# Altium project Fast_Servo.PrjPCB (part 1 of 7)
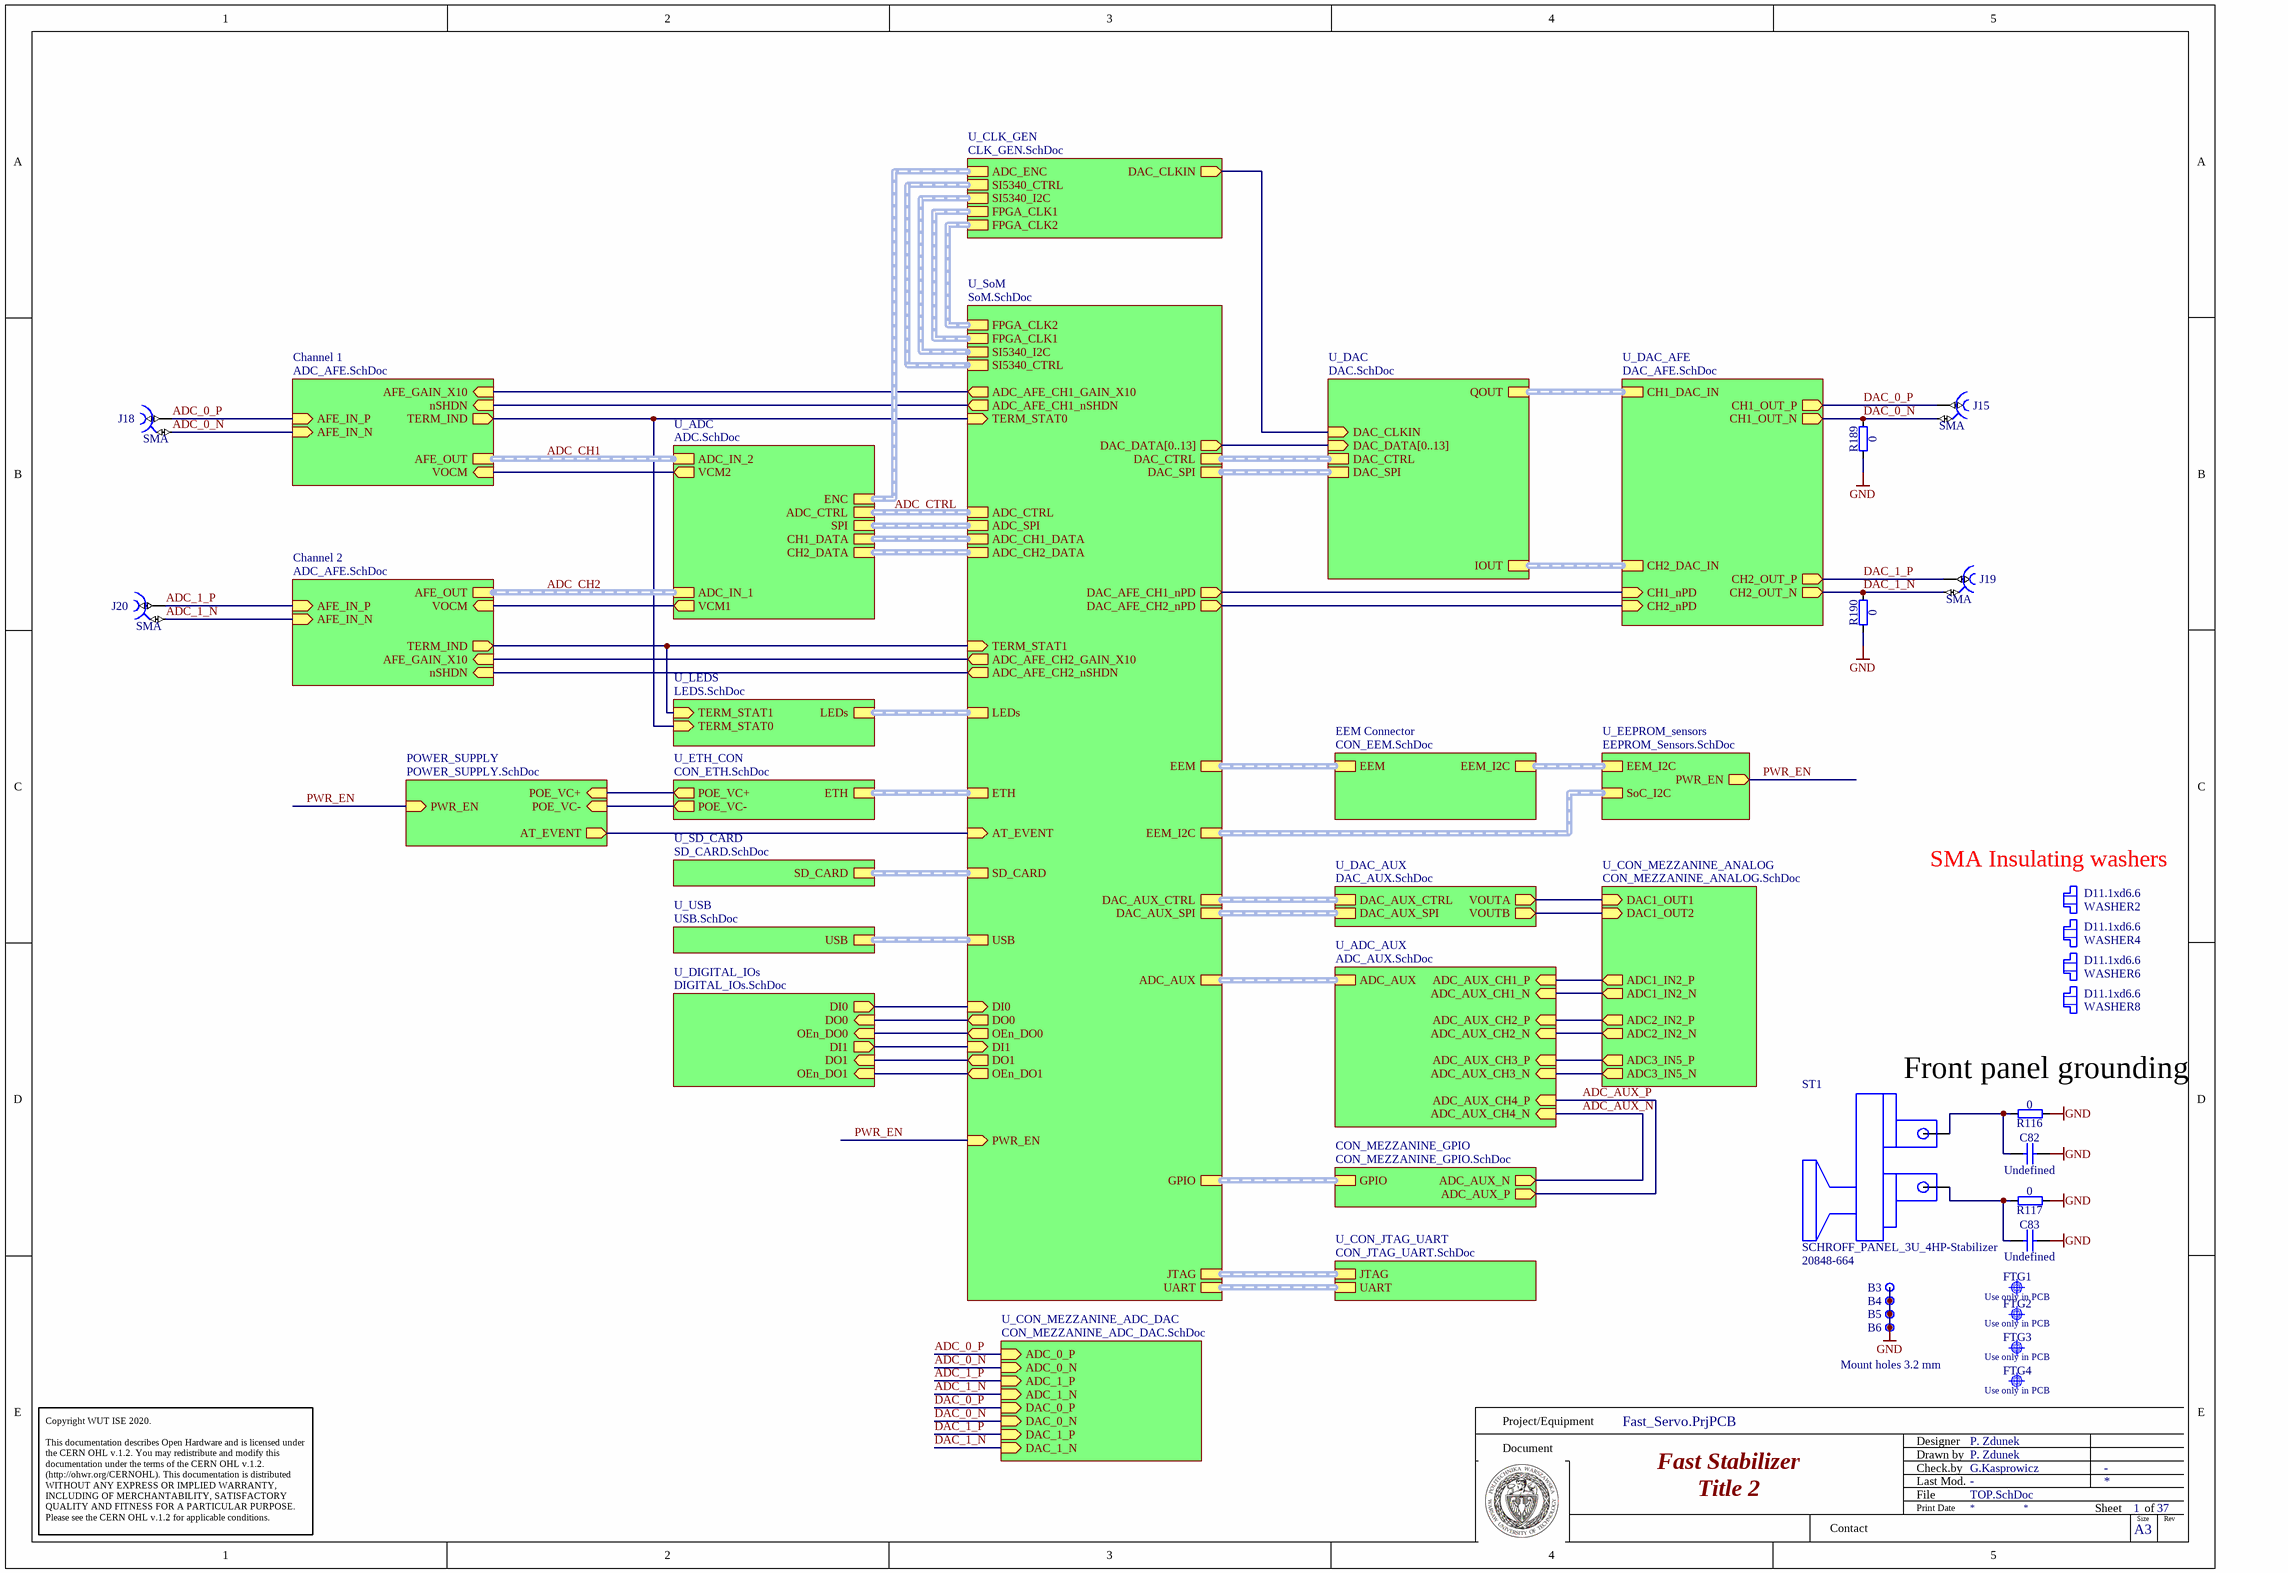
[diagram p0: TOP.SchDoc]
27 sheets, 668 parts. Net scope: hierarchical (ports join the sheet entries above them; power ports are global).
Board files: Fast_Servo.PCBDOC, Panel_Fast_Servo.PcbDoc
Sheets:
  TOP.SchDoc
    U_SoM = SOM.SchDoc
      U_SoM_JB2 = SOM_JB2.SchDoc
      U_SOM_JB1 = SOM_JB1.SchDoc
      U_SOM_JB3 = SOM_JB3.SchDoc
    U_LEDS = LEDS.SchDoc
    U_ADC = ADC.SchDoc
    Channel 2 = ADC_AFE.SchDoc
    Channel 1 = ADC_AFE.SchDoc
    U_DAC_AFE = DAC_AFE.SchDoc
    U_DAC = DAC.SchDoc
    CON_MEZZANINE_GPIO = CON_MEZZANINE_GPIO.SchDoc
    EEM Connector = CON_EEM.SchDoc
    U_EEPROM_sensors = EEPROM_Sensors.SchDoc
    U_DAC_AUX = DAC_AUX.SchDoc
    U_CON_MEZZANINE_ANALOG = CON_MEZZANINE_ANALOG.SchDoc
    U_ADC_AUX = ADC_AUX.SchDoc
    U_CLK_GEN = CLK_GEN.SchDoc
    U_CON_MEZZANINE_ADC_DAC = CON_MEZZANINE_ADC_DAC.SchDoc
    U_ETH_CON = CON_ETH.SchDoc
    POWER_SUPPLY = POWER_SUPPLY.SchDoc
      U_PWR_SMPS = PWR_SMPS.SchDoc
      PWR_P12V0A_N12V0A = PWR_P12V0A_N12V0A.SchDoc
      U_PWR_LDOs = PWR_LDOs.SchDoc
    U_SD_CARD = SD_CARD.SchDoc
    U_USB = USB.SchDoc
    U_DIGITAL_IOs = DIGITAL_IOs.SchDoc
    U_CON_JTAG_UART = CON_JTAG_UART.SchDoc

## Sheet TOP.SchDoc: Fast Stabilizer
size 420 x 297 mm; CheckedBy: G.Kasprowicz; Author: P. Zdunek; DrawnBy: P. Zdunek; Organization: Altium Limited; DocumentNumber: 1; SheetNumber: 1; SheetTotal: 37; Designer: P. Zdunek; ModifiedBy: -; CheckedDate: -; Title2: Title 2; DivGrp: WUT ISE

### Parts
B3  Plated Hole  [MTG320_550]  (value not drawn)  (no BOM)
B4  Plated Hole  [MTG320_550]  (value not drawn)  (no BOM)
B5  Plated Hole  [MTG320_550]  (value not drawn)  (no BOM)
B6  Plated Hole  [MTG320_550]  (value not drawn)  (no BOM)
C82  Undefined  [CAPC1608X90N]
C83  Undefined  [CAPC1608X90N]
FTG1  Use only in PCB  [FIDUCIAL_TOP_C100-200]  (no BOM)
FTG2  Use only in PCB  [FIDUCIAL_TOP_S100-200]  (no BOM)
FTG3  Use only in PCB  [FIDUCIAL_TOP_S100-200]  (no BOM)
FTG4  Use only in PCB  [FIDUCIAL_TOP_S100-200]  (no BOM)
J15  SMA  [DELOCK_65848]
J18  SMA  [DELOCK_65848]
J19  SMA  [DELOCK_65848]
J20  SMA  [DELOCK_65848]
R116  0  [RESC1005X40N]
R117  0  [RESC1005X40N]
R189  0  [RESC1005X40N]
R190  0  [RESC1005X40N]
ST1  SCHROFF_PANEL_3U_4HP-Stabilizer  Manufacturer Part Number 2: 20848-664  [SCHROFF_PANEL_3HP_4U - Stabilizer]
WASHER2  D11.1xd6.6  [Keystone_7687]
WASHER4  D11.1xd6.6  [Keystone_7687]
WASHER6  D11.1xd6.6  [Keystone_7687]
WASHER8  D11.1xd6.6  [Keystone_7687]

### Sub-sheets
Channel 1 = ADC_AFE.SchDoc: AFE_OUT (harness DIFF_SIGNAL), VOCM (in), AFE_IN_P (in), AFE_IN_N (in), nSHDN (in), AFE_GAIN_X10 (in), TERM_IND (out)
Channel 2 = ADC_AFE.SchDoc: AFE_OUT (harness DIFF_SIGNAL), VOCM (in), AFE_IN_P (in), AFE_IN_N (in), nSHDN (in), AFE_GAIN_X10 (in), TERM_IND (out)
CON_MEZZANINE_GPIO = CON_MEZZANINE_GPIO.SchDoc: GPIO (harness GPIO), ADC_AUX_P (out), ADC_AUX_N (out)
EEM Connector = CON_EEM.SchDoc: EEM (harness EEM), EEM_I2C (harness EEM_I2C)
POWER_SUPPLY = POWER_SUPPLY.SchDoc: POE_VC+ (in), POE_VC- (in), AT_EVENT (out), PWR_EN (in)
U_ADC = ADC.SchDoc: ADC_IN_1 (harness DIFF_SIGNAL), VCM1 (out), VCM2 (out), ADC_IN_2 (harness DIFF_SIGNAL), CH1_DATA (harness LTC2195_DATA), CH2_DATA (harness LTC2195_DATA), SPI (harness LTC2195_SPI), ENC (harness DIFFCLK), ADC_CTRL (harness LTC2195_CTRL)
U_ADC_AUX = ADC_AUX.SchDoc: ADC_AUX_CH3_P (in), ADC_AUX_CH3_N (in), ADC_AUX_CH2_P (in), ADC_AUX_CH2_N (in), ADC_AUX_CH1_P (in), ADC_AUX_CH1_N (in), ADC_AUX (harness ADC_AUX), ADC_AUX_CH4_N (in), ADC_AUX_CH4_P (in)
U_CLK_GEN = CLK_GEN.SchDoc: SI5340_CTRL (harness SI5340_CTRL), SI5340_I2C (harness I2C), FPGA_CLK1 (harness DIFFCLK), FPGA_CLK2 (harness DIFFCLK), DAC_CLKIN (out), ADC_ENC (harness DIFFCLK)
U_CON_JTAG_UART = CON_JTAG_UART.SchDoc: JTAG (harness JTAG), UART (harness UART)
U_CON_MEZZANINE_ADC_DAC = CON_MEZZANINE_ADC_DAC.SchDoc: ADC_0_P (in), ADC_0_N (in), ADC_1_P (in), ADC_1_N (in), DAC_0_P (in), DAC_0_N (in), DAC_1_P (in), DAC_1_N (in)
U_CON_MEZZANINE_ANALOG = CON_MEZZANINE_ANALOG.SchDoc: ADC1_IN2_P (out), ADC1_IN2_N (out), ADC2_IN2_N (out), ADC2_IN2_P (out), ADC3_IN5_P (out), ADC3_IN5_N (out), DAC1_OUT1 (in), DAC1_OUT2 (in)
U_DAC = DAC.SchDoc: QOUT (harness DIFF_SIGNAL), IOUT (harness DIFF_SIGNAL), DAC_DATA[0..13] (in), DAC_CTRL (harness AD9117_DAC_CTRL), DAC_SPI (harness AD9117_DAC_SPI), DAC_CLKIN (in)
U_DAC_AFE = DAC_AFE.SchDoc: CH1_nPD (in), CH1_OUT_P (out), CH1_DAC_IN (harness DIFF_SIGNAL), CH2_DAC_IN (harness DIFF_SIGNAL), CH2_OUT_P (out), CH2_nPD (in), CH1_OUT_N (out), CH2_OUT_N (out)
U_DAC_AUX = DAC_AUX.SchDoc: VOUTA (out), VOUTB (out), DAC_AUX_CTRL (harness DAC_AUX_CTRL), DAC_AUX_SPI (harness DAC_AUX_SPI)
U_DIGITAL_IOs = DIGITAL_IOs.SchDoc: DI1 (out), DI0 (out), OEn_DO0 (in), DO0 (in), OEn_DO1 (in), DO1 (in)
U_EEPROM_sensors = EEPROM_Sensors.SchDoc: EEM_I2C (harness EEM_I2C), SoC_I2C (harness EEM_I2C), PWR_EN (out)
U_ETH_CON = CON_ETH.SchDoc: ETH (harness ETH), POE_VC+ (out), POE_VC- (out)
U_LEDS = LEDS.SchDoc: LEDs (harness LEDs), TERM_STAT1 (in), TERM_STAT0 (in)
U_SD_CARD = SD_CARD.SchDoc: SD_CARD (harness SD_CARD)
U_SoM = SoM.SchDoc: EEM (harness EEM), EEM_I2C (harness EEM_I2C), TERM_STAT1 (in), ADC_AFE_CH2_GAIN_X10 (out), ADC_AFE_CH1_GAIN_X10 (out), TERM_STAT0 (in), LEDs (harness LEDs), ADC_AUX (harness ADC_AUX), DAC_AUX_CTRL (harness DAC_AUX_CTRL), DAC_AUX_SPI (harness DAC_AUX_SPI), DAC_DATA[0..13] (out), DAC_CTRL (harness AD9117_DAC_CTRL), DAC_AFE_CH1_nPD (out), FPGA_CLK2 (harness DIFFCLK), JTAG (harness JTAG), UART (harness UART), GPIO (harness GPIO), SI5340_CTRL (harness SI5340_CTRL), ADC_AFE_CH2_nSHDN (out), ADC_AFE_CH1_nSHDN (out), FPGA_CLK1 (harness DIFFCLK), SI5340_I2C (harness I2C), DAC_SPI (harness AD9117_DAC_SPI), ADC_CH2_DATA (harness LTC2195_DATA), ADC_CH1_DATA (harness LTC2195_DATA), ADC_SPI (harness LTC2195_SPI), ADC_CTRL (harness LTC2195_CTRL), DAC_AFE_CH2_nPD (out), ETH (harness ETH), SD_CARD (harness SD_CARD), USB (harness USB), DI0 (in), DI1 (in), AT_EVENT (in), DO0 (out), OEn_DO0 (out), DO1 (out), OEn_DO1 (out), PWR_EN (in)
U_USB = USB.SchDoc: USB (harness USB)

### Nets
GND: B3.1 B4.1 B5.1 B6.1 C82.2 C83.2 R116.1 R117.1 R189.1 R190.1
ADC_0_N: J18.2 ; sheet Channel 1/AFE_IN_N, sheet U_CON_MEZZANINE_ADC_DAC/ADC_0_N
ADC_0_P: J18.1 ; sheet Channel 1/AFE_IN_P, sheet U_CON_MEZZANINE_ADC_DAC/ADC_0_P
ADC_1_N: J20.2 ; sheet Channel 2/AFE_IN_N, sheet U_CON_MEZZANINE_ADC_DAC/ADC_1_N
ADC_1_P: J20.1 ; sheet Channel 2/AFE_IN_P, sheet U_CON_MEZZANINE_ADC_DAC/ADC_1_P
ADC_AFE_CH1_nSHDN: sheet U_SoM/ADC_AFE_CH1_nSHDN, sheet Channel 1/nSHDN
ADC_AFE_CH2_nSHDN: sheet U_SoM/ADC_AFE_CH2_nSHDN, sheet Channel 2/nSHDN
ADC_AUX_CH1_N: sheet U_CON_MEZZANINE_ANALOG/ADC1_IN2_N, sheet U_ADC_AUX/ADC_AUX_CH1_N
ADC_AUX_CH1_P: sheet U_CON_MEZZANINE_ANALOG/ADC1_IN2_P, sheet U_ADC_AUX/ADC_AUX_CH1_P
ADC_AUX_CH2_N: sheet U_CON_MEZZANINE_ANALOG/ADC2_IN2_N, sheet U_ADC_AUX/ADC_AUX_CH2_N
ADC_AUX_CH2_P: sheet U_CON_MEZZANINE_ANALOG/ADC2_IN2_P, sheet U_ADC_AUX/ADC_AUX_CH2_P
ADC_AUX_CH3_N: sheet U_CON_MEZZANINE_ANALOG/ADC3_IN5_N, sheet U_ADC_AUX/ADC_AUX_CH3_N
ADC_AUX_CH3_P: sheet U_CON_MEZZANINE_ANALOG/ADC3_IN5_P, sheet U_ADC_AUX/ADC_AUX_CH3_P
ADC_AUX_N: sheet CON_MEZZANINE_GPIO/ADC_AUX_N, sheet U_ADC_AUX/ADC_AUX_CH4_N
ADC_AUX_P: sheet CON_MEZZANINE_GPIO/ADC_AUX_P, sheet U_ADC_AUX/ADC_AUX_CH4_P
AFE_GAIN_X10: sheet U_SoM/ADC_AFE_CH2_GAIN_X10, sheet Channel 2/AFE_GAIN_X10
AFE_GAIN_X10: sheet U_SoM/ADC_AFE_CH1_GAIN_X10, sheet Channel 1/AFE_GAIN_X10  [a separate net that carries the same name]
AT_EVENT: sheet U_SoM/AT_EVENT, sheet POWER_SUPPLY/AT_EVENT
DAC_0_N: J15.2 R189.2 ; sheet U_DAC_AFE/CH1_OUT_N, sheet U_CON_MEZZANINE_ADC_DAC/DAC_0_N
DAC_0_P: J15.1 ; sheet U_DAC_AFE/CH1_OUT_P, sheet U_CON_MEZZANINE_ADC_DAC/DAC_0_P
DAC_1_N: J19.2 R190.2 ; sheet U_DAC_AFE/CH2_OUT_N, sheet U_CON_MEZZANINE_ADC_DAC/DAC_1_N
DAC_1_P: J19.1 ; sheet U_DAC_AFE/CH2_OUT_P, sheet U_CON_MEZZANINE_ADC_DAC/DAC_1_P
DAC_AFE_CH1_nPD: sheet U_SoM/DAC_AFE_CH1_nPD, sheet U_DAC_AFE/CH1_nPD
DAC_AFE_CH2_nPD: sheet U_SoM/DAC_AFE_CH2_nPD, sheet U_DAC_AFE/CH2_nPD
DAC_CLKIN: sheet U_DAC/DAC_CLKIN, sheet U_CLK_GEN/DAC_CLKIN
DI0: sheet U_SoM/DI0, sheet U_DIGITAL_IOs/DI0
DI1: sheet U_SoM/DI1, sheet U_DIGITAL_IOs/DI1
DO0: sheet U_SoM/DO0, sheet U_DIGITAL_IOs/DO0
DO1: sheet U_SoM/DO1, sheet U_DIGITAL_IOs/DO1
OEn_DO0: sheet U_SoM/OEn_DO0, sheet U_DIGITAL_IOs/OEn_DO0
OEn_DO1: sheet U_SoM/OEn_DO1, sheet U_DIGITAL_IOs/OEn_DO1
POE_VC+: sheet U_ETH_CON/POE_VC+, sheet POWER_SUPPLY/POE_VC+
POE_VC-: sheet U_ETH_CON/POE_VC-, sheet POWER_SUPPLY/POE_VC-
PWR_EN: sheet U_SoM/PWR_EN, sheet U_EEPROM_sensors/PWR_EN, sheet POWER_SUPPLY/PWR_EN
TERM_STAT0: sheet U_SoM/TERM_STAT0, sheet U_LEDS/TERM_STAT0, sheet Channel 1/TERM_IND
TERM_STAT1: sheet U_SoM/TERM_STAT1, sheet U_LEDS/TERM_STAT1, sheet Channel 2/TERM_IND
VCM1: sheet U_ADC/VCM1, sheet Channel 2/VOCM
VCM2: sheet U_ADC/VCM2, sheet Channel 1/VOCM
VOUTA: sheet U_DAC_AUX/VOUTA, sheet U_CON_MEZZANINE_ANALOG/DAC1_OUT1
VOUTB: sheet U_DAC_AUX/VOUTB, sheet U_CON_MEZZANINE_ANALOG/DAC1_OUT2
NetC82_1: C82.1 R116.2 ST1.1
NetC83_1: C83.1 R117.2 ST1.0

### Buses and harness runs
bus sheet U_DAC/DAC_DATA[0..13] = sheet U_SoM/DAC_DATA[0..13]
harness ADC_CH1 = sheet Channel 1/AFE_OUT = sheet U_ADC/ADC_IN_2
harness ADC_CH2 = sheet Channel 2/AFE_OUT = sheet U_ADC/ADC_IN_1
harness ADC_CTRL = sheet U_ADC/ADC_CTRL = sheet U_SoM/ADC_CTRL
harness sheet CON_MEZZANINE_GPIO/GPIO = sheet U_SoM/GPIO
harness sheet EEM Connector/EEM = sheet U_SoM/EEM
harness sheet EEM Connector/EEM_I2C = sheet U_EEPROM_sensors/EEM_I2C
harness sheet U_ADC/CH1_DATA = sheet U_SoM/ADC_CH1_DATA
harness sheet U_ADC/CH2_DATA = sheet U_SoM/ADC_CH2_DATA
harness sheet U_ADC/ENC = sheet U_CLK_GEN/ADC_ENC
harness sheet U_ADC/SPI = sheet U_SoM/ADC_SPI
harness sheet U_ADC_AUX/ADC_AUX = sheet U_SoM/ADC_AUX
harness sheet U_CLK_GEN/FPGA_CLK1 = sheet U_SoM/FPGA_CLK1
harness sheet U_CLK_GEN/FPGA_CLK2 = sheet U_SoM/FPGA_CLK2
harness sheet U_CLK_GEN/SI5340_CTRL = sheet U_SoM/SI5340_CTRL
harness sheet U_CLK_GEN/SI5340_I2C = sheet U_SoM/SI5340_I2C
harness sheet U_CON_JTAG_UART/JTAG = sheet U_SoM/JTAG
harness sheet U_CON_JTAG_UART/UART = sheet U_SoM/UART
harness sheet U_DAC/DAC_CTRL = sheet U_SoM/DAC_CTRL
harness sheet U_DAC/DAC_SPI = sheet U_SoM/DAC_SPI
harness sheet U_DAC/IOUT = sheet U_DAC_AFE/CH2_DAC_IN
harness sheet U_DAC/QOUT = sheet U_DAC_AFE/CH1_DAC_IN
harness sheet U_DAC_AUX/DAC_AUX_CTRL = sheet U_SoM/DAC_AUX_CTRL
harness sheet U_DAC_AUX/DAC_AUX_SPI = sheet U_SoM/DAC_AUX_SPI
harness sheet U_EEPROM_sensors/SoC_I2C = sheet U_SoM/EEM_I2C
harness sheet U_ETH_CON/ETH = sheet U_SoM/ETH
harness sheet U_LEDS/LEDs = sheet U_SoM/LEDs
harness sheet U_SD_CARD/SD_CARD = sheet U_SoM/SD_CARD
harness sheet U_SoM/USB = sheet U_USB/USB

### Notes on the sheet
- (near WASHER2) SMA Insulating washers
- (near R116) Front panel grounding
- Mount holes 3.2 mm
- Project/Equipment
- Document
- Designer
- Drawn by
- Check.by
- Copyright WUT ISE 2020.
  This documentation describes Open Hardware and is licensed under the CERN OHL v.1.2. You may redistribute and modify this documentation under the terms of the CERN OHL v.1.2. (http://ohwr.org/CERNOHL). This documentation is distributed WITHOUT ANY EXPRESS OR IMPLIED WARRANTY, INCLUDING OF MERCHANTABILITY, SATISFACTORY QUALITY AND FITNESS FOR A PARTICULAR PURPOSE. Please see the CERN OHL v.1.2 for applicable conditions.
- Contact
- File
- Last Mod.
- Print Date
- Sheet
- Size
- A3
- of
- Rev

### Library data of the parts
B3-B6 = PLATED_HOLE3.2_PAD5.5: Single Terminal Socket; Part Description: Plated Through Hole: Hole Dia.=3.2mm Pad Dia.=5.5mm; Mounted: No; Part Number: PLATED_HOLE3.2_PAD5.5; Component Type: Standard (No BOM); Pin Count: 1; Family: Plated Hole; Socket: No; SMD: No; Sense: No; Status: None; ComponentHeight: 0mm; HelpURL: Undefined; Author: CERN DEM JMW; CreateDate: 01/10/2012; LatestRevisionDate: 01/10/2012; PackageDescription: Plated Through Hole: Hole Dia.=3.2mm Pad Dia.=5.5mm
C82 C83 = CC0603_NO-VALUE: Non-polarised capacitor; Part Description: Reserved Footprint For 0603(1608) Chip Ceramic Capacitor; Mounted: No; Part Number: CC0603_NO-VALUE; Component Kind: Standard; Component Type: Standard; Pin Count: 2; Value: Undefined; Status: None; Manufacturer: Undefined; Manufacturer Part Number: CC0603_NO-VALUE; Case: 0603; Socket: No; SMD: Yes; Sense: No; Manufacturer1 ComponentHeight: 0.9mm; HelpURL: Undefined; Author: CERN DEM MR; CreateDate: 22.11.2016; LatestRevisionDate: 22.11.2016
FTG1 = FIDUCIAL_TARGET_C100-200: Fiducial Target; Part Description: Round Fiducial Target, Top Layer, 1.0mm, Top Solder 2.0mm, Keepout =2.0mm; Mounted: No; Part Number: FIDUCIAL_TARGET_C100-200; Component Type: Standard (No BOM); Pin Count: 1; Family: Fiducial; Socket: No; SMD: Yes; Sense: No; Status: None; ComponentHeight: 0mm; HelpURL: Undefined; Author: CERN DEM JLC; CreateDate: 09.02.2010; LatestRevisionDate: 04.04.2012; PackageDescription: Round Fiducial Target, Top Layer, 1.0mm, Top Solder 2.0mm, Keepout =2.0mm
FTG2-FTG4 = FIDUCIAL_TARGET_S100-200: Fiducial Target; Part Description: Square Fiducial Target, Top Layer, 1.0mm, Top Solder 2.0mm, Keepout =2.0mm; Mounted: No; Part Number: FIDUCIAL_TARGET_S100-200; Component Type: Standard (No BOM); Pin Count: 1; Family: Fiducial; Socket: No; SMD: Yes; Sense: No; Status: None; ComponentHeight: 0mm; HelpURL: Undefined; Author: CERN DEM JLC; CreateDate: 09.02.2010; LatestRevisionDate: 04.04.2012; PackageDescription: Square Fiducial Target, Top Layer, 1.0mm, Top Solder 2.0mm, Keepout =2.0mm
J15 J18-J20 = CON_SMA_DELOCK_65848: 50 Ohm Through Hole SMA Right Angle PCB Jack; Manufacturer: DELOCK; Manufacturer Part Number: 5848 (4043619658480); PressFit: No; Part Number: DELOCK_65848; Component Kind: Standard; Component Type: Standard; Pin Count: 5; Family: SMA; Mounted: Yes; Socket: No; SMD: No; Sense: No; Status: None; Part Description: 50 Ohm Through Hole SMA Right Angle PCB Jack; ComponentHeight: 12.5; HelpURL: \\cern.ch\dfs\Applications\Altium\Datasheets\AMPHENOL_132203-16.pdf; Author: GK; CreateDate: 13.05.2019; LatestRevisionDate: 13.05.2019
R116 R117 R189 R190 = R0402_0R_JUMPER: Resistor; Part Description: 1A (0.05R Max DC Resistance) Zero Ohm Jumper; Manufacturer: GENERIC; Manufacturer1 Part Number: 232270591001L; PressFit: No; Part Number: R0402_0R_JUMPER; Component Kind: Standard; Component Type: Standard; Pin Count: 2; Value: 0; Status: Not Recommended; Manufacturer Part Number: R0402_0R_JUMPER; Case: 0402; Mounted: Yes; Sense: No; Socket: No; SMD: Yes; Manufacturer1 Example: YAGEO PHYCOMP; Manufacturer1 ComponentHeight: 0.4mm; HelpURL: \\cern.ch\dfs\Applications\Altium\Datasheets\R0402_Phycomp_RC0402.pdf; Author: CERN DEM JLC; CreateDate: 03/12/2007; LatestRevisionDate: 17/10/2012
ST1 = SCHROFF_PANEL_3U_4HP_Stabilizer: Schroff 3HP 4U EUROCARD Panel; Manufacturer Part Number: 20818-017; Manufacturer: Schroff
WASHER2 WASHER4 WASHER6 WASHER8 = Keystone_7687: SMA_Shoulder Washer; Part Number: Custom 3D printed; Part Description: Polyphenylene Sulfide PPS Shoulder Washer; PressFit: No; Component Kind: Standard; Component Type: Mechanical; Footprint: Custom 3D printed; Pin Count: 0; PackageDescription: Polyphenylene Sulfide PPS Shoulder Washer; Mounted: Yes; Socket: No; SMD: No; Sense: No; Status: None; Value: D11.1xd6.6; Manufacturer: Custom 3D printed; Manufacturer Part Number: Custom 3D printed; ComponentHeight: 1.91mm; HelpURL: \\cern.ch\dfs\Applications\Altium\Datasheets\AAVID-THERMALLOY_7721-7PPSG.pdf; Author: GK; CreateDate: 28.01.2016; LatestRevisionDate: 28.01.2016

## Sheet SOM.SchDoc: SoM TE0720
size 420 x 297 mm; Author: P. Zdunek; DrawnBy: P. Zdunek; DocumentNumber: 2; SheetNumber: 2; SheetTotal: 37; ModifiedBy: -; CheckedDate: -; Title2: Fast Stabilizer; DivGrp: WUT ISE; Designer: G.Kasprowicz
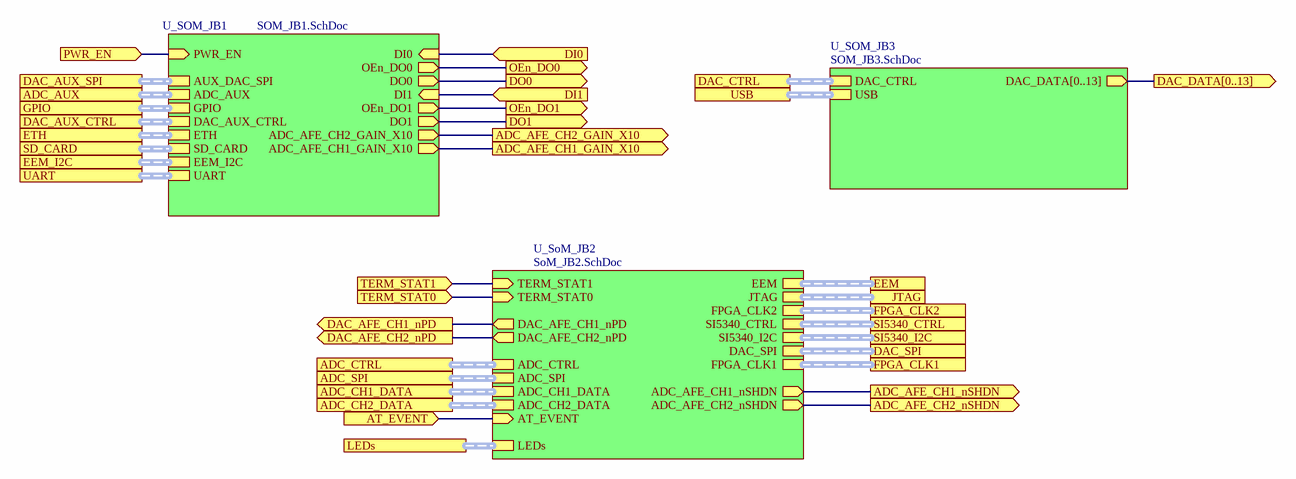
[diagram p1: SOM.SchDoc]

### Sub-sheets
U_SOM_JB1 = SOM_JB1.SchDoc: ETH (harness ETH), SD_CARD (harness SD_CARD), EEM_I2C (harness EEM_I2C), UART (harness UART), DAC_AUX_CTRL (harness DAC_AUX_CTRL), DI0 (in), ADC_AUX (harness ADC_AUX), ADC_AFE_CH1_GAIN_X10 (out), GPIO (harness GPIO), AUX_DAC_SPI (harness DAC_AUX_SPI), ADC_AFE_CH2_GAIN_X10 (out), DI1 (in), OEn_DO0 (out), DO0 (out), OEn_DO1 (out), DO1 (out), PWR_EN (in)
U_SoM_JB2 = SoM_JB2.SchDoc: JTAG (harness JTAG), EEM (harness EEM), TERM_STAT0 (in), TERM_STAT1 (in), DAC_AFE_CH2_nPD (out), DAC_AFE_CH1_nPD (out), ADC_CTRL (harness LTC2195_CTRL), ADC_CH2_DATA (harness LTC2195_DATA), ADC_SPI (harness LTC2195_SPI), ADC_CH1_DATA (harness LTC2195_DATA), FPGA_CLK2 (harness DIFFCLK), AT_EVENT (in), ADC_AFE_CH2_nSHDN (out), SI5340_I2C (harness I2C), DAC_SPI (harness AD9117_DAC_SPI), FPGA_CLK1 (harness DIFFCLK), ADC_AFE_CH1_nSHDN (out), SI5340_CTRL (harness SI5340_CTRL), LEDs (harness LEDs)
U_SOM_JB3 = SOM_JB3.SchDoc: DAC_DATA[0..13] (out), USB (harness USB), DAC_CTRL (harness AD9117_DAC_CTRL)

### Ports
ADC_AFE_CH1_GAIN_X10 (out), ADC_AFE_CH1_nSHDN (out), ADC_AFE_CH2_GAIN_X10 (out), ADC_AFE_CH2_nSHDN (out), ADC_AUX (harness ADC_AUX), ADC_CH1_DATA (harness LTC2195_DATA), ADC_CH2_DATA (harness LTC2195_DATA), ADC_CTRL (harness LTC2195_CTRL), ADC_SPI (harness LTC2195_SPI), AT_EVENT (in), DAC_AFE_CH1_nPD (out), DAC_AFE_CH2_nPD (out), DAC_AUX_CTRL (harness DAC_AUX_CTRL), DAC_AUX_SPI (harness DAC_AUX_SPI), DAC_CTRL (harness AD9117_DAC_CTRL), DAC_DATA[0..13] (out), DAC_SPI (harness AD9117_DAC_SPI), DI0 (in), DI1 (in), DO0 (out), DO1 (out), EEM (harness EEM), EEM_I2C (harness EEM_I2C), ETH (harness ETH), FPGA_CLK1 (harness DIFFCLK), FPGA_CLK2 (harness DIFFCLK), GPIO (harness GPIO), JTAG (harness JTAG), LEDs (harness LEDs), OEn_DO0 (out), OEn_DO1 (out), PWR_EN (in), SD_CARD (harness SD_CARD), SI5340_CTRL (harness SI5340_CTRL), SI5340_I2C (harness I2C), TERM_STAT0 (in), TERM_STAT1 (in), UART (harness UART), USB (harness USB)

### Nets
ADC_AFE_CH1_nSHDN: port ADC_AFE_CH1_nSHDN, sheet U_SoM_JB2/ADC_AFE_CH1_nSHDN
ADC_AFE_CH2_nSHDN: port ADC_AFE_CH2_nSHDN, sheet U_SoM_JB2/ADC_AFE_CH2_nSHDN
AFE_GAIN_X10: port ADC_AFE_CH2_GAIN_X10, sheet U_SOM_JB1/ADC_AFE_CH2_GAIN_X10
AFE_GAIN_X10: port ADC_AFE_CH1_GAIN_X10, sheet U_SOM_JB1/ADC_AFE_CH1_GAIN_X10  [a separate net that carries the same name]
AT_EVENT: port AT_EVENT, sheet U_SoM_JB2/AT_EVENT
DAC_AFE_CH1_nPD: port DAC_AFE_CH1_nPD, sheet U_SoM_JB2/DAC_AFE_CH1_nPD
DAC_AFE_CH2_nPD: port DAC_AFE_CH2_nPD, sheet U_SoM_JB2/DAC_AFE_CH2_nPD
DI0: port DI0, sheet U_SOM_JB1/DI0
DI1: port DI1, sheet U_SOM_JB1/DI1
DO0: port DO0, sheet U_SOM_JB1/DO0
DO1: port DO1, sheet U_SOM_JB1/DO1
OEn_DO0: port OEn_DO0, sheet U_SOM_JB1/OEn_DO0
OEn_DO1: port OEn_DO1, sheet U_SOM_JB1/OEn_DO1
PWR_EN: port PWR_EN, sheet U_SOM_JB1/PWR_EN
TERM_STAT0: port TERM_STAT0, sheet U_SoM_JB2/TERM_STAT0
TERM_STAT1: port TERM_STAT1, sheet U_SoM_JB2/TERM_STAT1

### Buses and harness runs
bus port DAC_DATA[0..13] = sheet U_SOM_JB3/DAC_DATA[0..13]
harness port ADC_AUX = sheet U_SOM_JB1/ADC_AUX
harness port ADC_CH1_DATA = sheet U_SoM_JB2/ADC_CH1_DATA
harness port ADC_CH2_DATA = sheet U_SoM_JB2/ADC_CH2_DATA
harness port ADC_CTRL = sheet U_SoM_JB2/ADC_CTRL
harness port ADC_SPI = sheet U_SoM_JB2/ADC_SPI
harness port DAC_AUX_CTRL = sheet U_SOM_JB1/DAC_AUX_CTRL
harness port DAC_AUX_SPI = sheet U_SOM_JB1/AUX_DAC_SPI
harness port DAC_CTRL = sheet U_SOM_JB3/DAC_CTRL
harness port DAC_SPI = sheet U_SoM_JB2/DAC_SPI
harness port EEM = sheet U_SoM_JB2/EEM
harness port EEM_I2C = sheet U_SOM_JB1/EEM_I2C
harness port ETH = sheet U_SOM_JB1/ETH
harness port FPGA_CLK1 = sheet U_SoM_JB2/FPGA_CLK1
harness port FPGA_CLK2 = sheet U_SoM_JB2/FPGA_CLK2
harness port GPIO = sheet U_SOM_JB1/GPIO
harness port JTAG = sheet U_SoM_JB2/JTAG
harness port LEDs = sheet U_SoM_JB2/LEDs
harness port SD_CARD = sheet U_SOM_JB1/SD_CARD
harness port SI5340_CTRL = sheet U_SoM_JB2/SI5340_CTRL
harness port SI5340_I2C = sheet U_SoM_JB2/SI5340_I2C
harness port UART = sheet U_SOM_JB1/UART
harness port USB = sheet U_SOM_JB3/USB

### Notes on the sheet
- Project/Equipment
- Document
- Designer
- Drawn by
- Check.by
- Copyright WUT ISE 2020.
  This documentation describes Open Hardware and is licensed under the CERN OHL v.1.2. You may redistribute and modify this documentation under the terms of the CERN OHL v.1.2. (http://ohwr.org/CERNOHL). This documentation is distributed WITHOUT ANY EXPRESS OR IMPLIED WARRANTY, INCLUDING OF MERCHANTABILITY, SATISFACTORY QUALITY AND FITNESS FOR A PARTICULAR PURPOSE. Please see the CERN OHL v.1.2 for applicable conditions.
- Contact
- File
- Last Mod.
- Print Date
- Sheet
- Size
- A3
- of
- Rev

## Sheet SOM_JB2.SchDoc: SoM TE0720 JB2
size 420 x 297 mm; Author: P. Zdunek; DrawnBy: P. Zdunek; Organization: Altium Limited; Address1: L3, 12a Rodborough Rd; Address2: Frenchs Forest; Address3: NSW; Address4: Australia 2086; DocumentNumber: 4; SheetNumber: 4; SheetTotal: 37; ModifiedBy: -; CheckedDate: -; Title2: Fast Stabilizer; DivGrp: WUT ISE; Designer: G.Kasprowicz
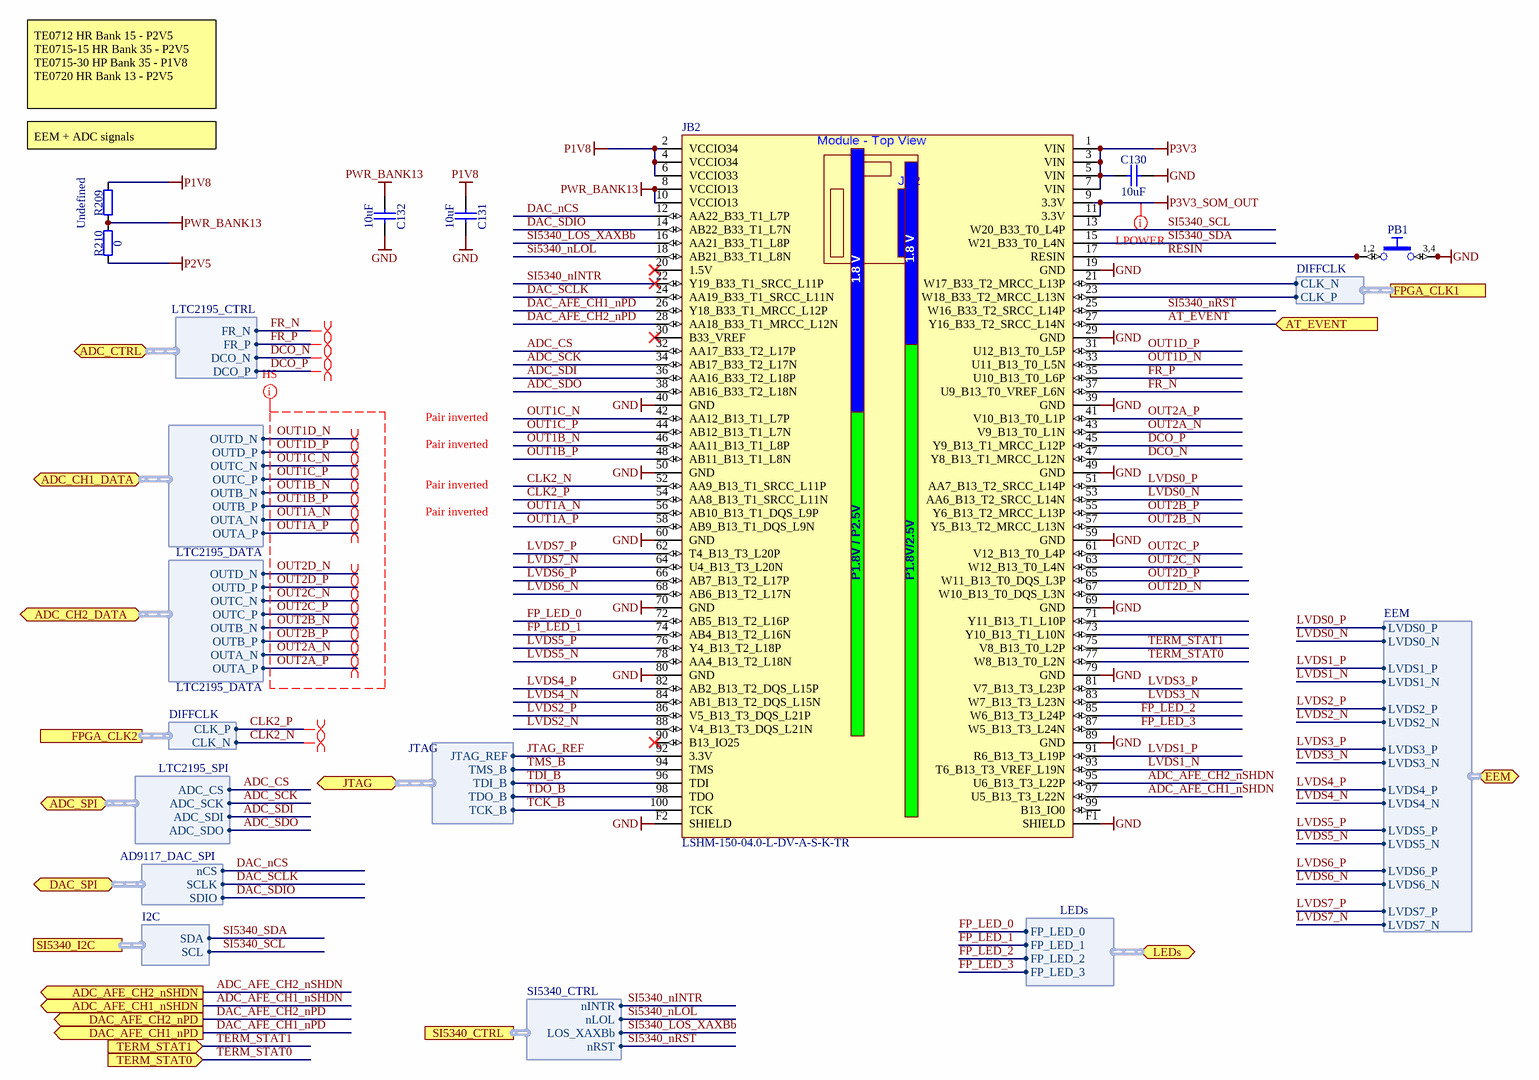
[diagram p2: SOM_JB2.SchDoc]

### Parts
C130  10uF  [CAPC1608X80N]
C131  10uF  [CAPC1608X80N]
C132  10uF  [CAPC1608X80N]
JB2  LSHM-150-04.0-L-DV-A-S-K-TR  [LSHM-150-XXX-X-DV-A-X]
PB1  Push Button  [PB_TYCO_FSM6JSMA]  (value not drawn)
R209  Undefined  [RESC1608X55N]
R210  0  [RESC1005X40N]

### Ports
ADC_AFE_CH1_nSHDN (out), ADC_AFE_CH2_nSHDN (out), ADC_CH1_DATA (bidir, harness LTC2195_DATA), ADC_CH2_DATA (bidir, harness LTC2195_DATA), ADC_CTRL (bidir, harness LTC2195_CTRL), ADC_SPI (bidir, harness LTC2195_SPI), AT_EVENT (in), DAC_AFE_CH1_nPD (out), DAC_AFE_CH2_nPD (out), DAC_SPI (bidir, harness AD9117_DAC_SPI), EEM (bidir, harness EEM), FPGA_CLK1 (harness DIFFCLK), FPGA_CLK2 (harness DIFFCLK), JTAG (bidir, harness JTAG), LEDs (bidir, harness LEDs), SI5340_CTRL (harness SI5340_CTRL), SI5340_I2C (harness I2C), TERM_STAT0 (in), TERM_STAT1 (in)

### Harnesses
JTAG: JTAG_REF, TDO_B, TMS_B, TDI_B, TCK_B
EEM: LVDS0_P, LVDS0_N, LVDS1_P, LVDS1_N, LVDS2_P, LVDS2_N, LVDS3_P, LVDS3_N, LVDS4_P, LVDS4_N, LVDS5_P, LVDS5_N, LVDS6_P, LVDS6_N, LVDS7_P, LVDS7_N
LTC2195_DATA: OUTD_N, OUTD_P, OUTC_N, OUTC_P, OUTB_N, OUTB_P, OUTA_N, OUTA_P
LTC2195_CTRL: FR_N, FR_P, DCO_N, DCO_P
DIFFCLK: CLK_P, CLK_N
LTC2195_SPI: ADC_CS, ADC_SCK, ADC_SDI, ADC_SDO
AD9117_DAC_SPI: SCLK, nCS, SDIO
I2C: SDA, SCL
SI5340_CTRL: nINTR, nLOL, LOS_XAXBb, nRST
LEDs: FP_LED_0, FP_LED_1, FP_LED_2, FP_LED_3

### Nets
GND: C130.2 C131.2 C132.2 JB2.19(GND) JB2.29(GND) JB2.39(GND) JB2.40(GND) JB2.49(GND) JB2.50(GND) JB2.59(GND) JB2.60(GND) JB2.69(GND) JB2.70(GND) JB2.79(GND) JB2.80(GND) JB2.89(GND) JB2.F1(SHIELD) JB2.F2(SHIELD) PB1.3 PB1.4
P1V8: C131.1 JB2.2(VCCIO34) JB2.4(VCCIO34) JB2.6(VCCIO33) R209.2
P2V5: R210.1
P3V3: C130.1 JB2.1(VIN) JB2.3(VIN) JB2.5(VIN) JB2.7(VIN)
P3V3_SOM_OUT: JB2.9(3.3V) JB2.11(3.3V)
PWR_BANK13: C132.1 JB2.8(VCCIO13) JB2.10(VCCIO13) R209.1 R210.2
ADC_AFE_CH1_nSHDN: JB2.97(U5_B13_T3_L22N) ; port ADC_AFE_CH1_nSHDN
ADC_AFE_CH2_nSHDN: JB2.95(U6_B13_T3_L22P) ; port ADC_AFE_CH2_nSHDN
ADC_CS: JB2.32(AA17_B33_T2_L17P) ; port ADC_SPI.ADC_CS
ADC_SCK: JB2.34(AB17_B33_T2_L17N) ; port ADC_SPI.ADC_SCK
ADC_SDI: JB2.36(AA16_B33_T2_L18P) ; port ADC_SPI.ADC_SDI
ADC_SDO: JB2.38(AB16_B33_T2_L18N) ; port ADC_SPI.ADC_SDO
AT_EVENT: JB2.27(Y16_B33_T2_SRCC_L14N) ; port AT_EVENT
CLK2_N: JB2.52(AA9_B13_T1_SRCC_L11P) ; port FPGA_CLK2.CLK_N
CLK2_P: JB2.54(AA8_B13_T1_SRCC_L11N) ; port FPGA_CLK2.CLK_P
DAC_AFE_CH1_nPD: JB2.26(Y18_B33_T1_MRCC_L12P) ; port DAC_AFE_CH1_nPD
DAC_AFE_CH2_nPD: JB2.28(AA18_B33_T1_MRCC_L12N) ; port DAC_AFE_CH2_nPD
DAC_nCS: JB2.12(AA22_B33_T1_L7P) ; port DAC_SPI.nCS
DAC_SCLK: JB2.24(AA19_B33_T1_SRCC_L11N) ; port DAC_SPI.SCLK
DAC_SDIO: JB2.14(AB22_B33_T1_L7N) ; port DAC_SPI.SDIO
DCO_N: JB2.47(Y8_B13_T1_MRCC_L12N) ; port ADC_CTRL.DCO_N  [project net ADC_CTRL.DCO_N]
DCO_P: JB2.45(Y9_B13_T1_MRCC_L12P) ; port ADC_CTRL.DCO_P  [project net ADC_CTRL.DCO_P]
FP_LED_0: JB2.72(AB5_B13_T2_L16P) ; port LEDs.FP_LED_0
FP_LED_1: JB2.74(AB4_B13_T2_L16N) ; port LEDs.FP_LED_1
FP_LED_2: JB2.85(W6_B13_T3_L24P) ; port LEDs.FP_LED_2
FP_LED_3: JB2.87(W5_B13_T3_L24N) ; port LEDs.FP_LED_3
FR_N: JB2.37(U9_B13_T0_VREF_L6N) ; port ADC_CTRL.FR_N  [project net ADC_CTRL.FR_N]
FR_P: JB2.35(U10_B13_T0_L6P) ; port ADC_CTRL.FR_P  [project net ADC_CTRL.FR_P]
JTAG_REF: JB2.92(3.3V) ; port JTAG.JTAG_REF  [project net JTAG.JTAG_REF]
LVDS0_N: JB2.53(AA6_B13_T2_SRCC_L14N) ; port EEM.LVDS0_N
LVDS0_P: JB2.51(AA7_B13_T2_SRCC_L14P) ; port EEM.LVDS0_P
LVDS1_N: JB2.93(T6_B13_T3_VREF_L19N) ; port EEM.LVDS1_N
LVDS1_P: JB2.91(R6_B13_T3_L19P) ; port EEM.LVDS1_P
LVDS2_N: JB2.88(V4_B13_T3_DQS_L21N) ; port EEM.LVDS2_N
LVDS2_P: JB2.86(V5_B13_T3_DQS_L21P) ; port EEM.LVDS2_P
LVDS3_N: JB2.83(W7_B13_T3_L23N) ; port EEM.LVDS3_N
LVDS3_P: JB2.81(V7_B13_T3_L23P) ; port EEM.LVDS3_P
LVDS4_N: JB2.84(AB1_B13_T2_DQS_L15N) ; port EEM.LVDS4_N
LVDS4_P: JB2.82(AB2_B13_T2_DQS_L15P) ; port EEM.LVDS4_P
LVDS5_N: JB2.78(AA4_B13_T2_L18N) ; port EEM.LVDS5_N
LVDS5_P: JB2.76(Y4_B13_T2_L18P) ; port EEM.LVDS5_P
LVDS6_N: JB2.68(AB6_B13_T2_L17N) ; port EEM.LVDS6_N
LVDS6_P: JB2.66(AB7_B13_T2_L17P) ; port EEM.LVDS6_P
LVDS7_N: JB2.64(U4_B13_T3_L20N) ; port EEM.LVDS7_N
LVDS7_P: JB2.62(T4_B13_T3_L20P) ; port EEM.LVDS7_P
OUT1A_N: JB2.56(AB10_B13_T1_DQS_L9P) ; port ADC_CH1_DATA.OUTA_N
OUT1A_P: JB2.58(AB9_B13_T1_DQS_L9N) ; port ADC_CH1_DATA.OUTA_P
OUT1B_N: JB2.46(AA11_B13_T1_L8P) ; port ADC_CH1_DATA.OUTB_N
OUT1B_P: JB2.48(AB11_B13_T1_L8N) ; port ADC_CH1_DATA.OUTB_P
OUT1C_N: JB2.42(AA12_B13_T1_L7P) ; port ADC_CH1_DATA.OUTC_N
OUT1C_P: JB2.44(AB12_B13_T1_L7N) ; port ADC_CH1_DATA.OUTC_P
OUT1D_N: JB2.33(U11_B13_T0_L5N) ; port ADC_CH1_DATA.OUTD_N
OUT1D_P: JB2.31(U12_B13_T0_L5P) ; port ADC_CH1_DATA.OUTD_P
OUT2A_N: JB2.43(V9_B13_T0_L1N) ; port ADC_CH2_DATA.OUTA_N
OUT2A_P: JB2.41(V10_B13_T0_L1P) ; port ADC_CH2_DATA.OUTA_P
OUT2B_N: JB2.57(Y5_B13_T2_MRCC_L13N) ; port ADC_CH2_DATA.OUTB_N
OUT2B_P: JB2.55(Y6_B13_T2_MRCC_L13P) ; port ADC_CH2_DATA.OUTB_P
OUT2C_N: JB2.63(W12_B13_T0_L4N) ; port ADC_CH2_DATA.OUTC_N
OUT2C_P: JB2.61(V12_B13_T0_L4P) ; port ADC_CH2_DATA.OUTC_P
OUT2D_N: JB2.67(W10_B13_T0_DQS_L3N) ; port ADC_CH2_DATA.OUTD_N
OUT2D_P: JB2.65(W11_B13_T0_DQS_L3P) ; port ADC_CH2_DATA.OUTD_P
RESIN: JB2.17(RESIN) PB1.1 PB1.2
SI5340_LOS_XAXBb: JB2.16(AA21_B33_T1_L8P) ; port SI5340_CTRL.LOS_XAXBb
SI5340_nINTR: JB2.22(Y19_B33_T1_SRCC_L11P) ; port SI5340_CTRL.nINTR
Si5340_nLOL: JB2.18(AB21_B33_T1_L8N) ; port SI5340_CTRL.nLOL
SI5340_nRST: JB2.25(W16_B33_T2_SRCC_L14P) ; port SI5340_CTRL.nRST
SI5340_SCL: JB2.13(W20_B33_T0_L4P) ; port SI5340_I2C.SCL
SI5340_SDA: JB2.15(W21_B33_T0_L4N) ; port SI5340_I2C.SDA
TCK_B: JB2.100(TCK) ; port JTAG.TCK_B  [project net JTAG.TCK_B]
TDI_B: JB2.96(TDI) ; port JTAG.TDI_B  [project net JTAG.TDI_B]
TDO_B: JB2.98(TDO) ; port JTAG.TDO_B  [project net JTAG.TDO_B]
TERM_STAT0: JB2.77(W8_B13_T0_L2N) ; port TERM_STAT0
TERM_STAT1: JB2.75(V8_B13_T0_L2P) ; port TERM_STAT1
TMS_B: JB2.94(TMS) ; port JTAG.TMS_B  [project net JTAG.TMS_B]
NetIC20_30: JB2.21(W17_B33_T2_MRCC_L13P) ; port FPGA_CLK1.CLK_N
NetIC20_31: JB2.23(W18_B33_T2_MRCC_L13N) ; port FPGA_CLK1.CLK_P

Not connected (* = marked no-connect by the designer): JB2 20(1.5V)* 30(B33_VREF)* 71(Y11_B13_T1_L10P) 73(Y10_B13_T1_L10N) 90(B13_IO25)* 99(B13_IO0)

### Layout directives
differential pair: ADC_CTRL.DCO_N, ADC_CTRL.DCO_P, ADC_CTRL.FR_N, ADC_CTRL.FR_P, CLK2_N, CLK2_P, OUT1A_N, OUT1A_P, OUT1B_N, OUT1B_P, OUT1C_N, OUT1C_P, OUT1D_N, OUT1D_P, OUT2A_N, OUT2A_P, OUT2B_N, OUT2B_P, OUT2C_N, OUT2C_P, OUT2D_N, OUT2D_P
net class HIGH_SPEED: OUT1A_N, OUT1A_P, OUT1B_N, OUT1B_P, OUT1C_N, OUT1C_P, OUT1D_N, OUT1D_P, OUT2A_N, OUT2A_P, OUT2B_N, OUT2B_P, OUT2C_N, OUT2C_P, OUT2D_N, OUT2D_P
net class Lpower: P3V3_SOM_OUT

### Notes on the sheet
- TE0712 HR Bank 15 - P2V5
  TE0715-15 HR Bank 35 - P2V5
  TE0715-30 HP Bank 35 - P1V8
  TE0720 HR Bank 13 - P2V5
- (near R209) EEM + ADC signals
- (near JB2) 1.8 V
- Pair inverted
- (near JB2) P1.8V / P2.5V
- (near JB2) P1.8V/2.5V
- Project/Equipment
- Document
- Designer
- Drawn by
- Check.by
- Copyright WUT ISE 2020.
  This documentation describes Open Hardware and is licensed under the CERN OHL v.1.2. You may redistribute and modify this documentation under the terms of the CERN OHL v.1.2. (http://ohwr.org/CERNOHL). This documentation is distributed WITHOUT ANY EXPRESS OR IMPLIED WARRANTY, INCLUDING OF MERCHANTABILITY, SATISFACTORY QUALITY AND FITNESS FOR A PARTICULAR PURPOSE. Please see the CERN OHL v.1.2 for applicable conditions.
- Contact
- File
- Last Mod.
- Print Date
- Sheet
- Size
- A3
- of
- Rev
- (in symbol 25286) Module - Top View
- (in symbol PB_TYCO_FSM6JSMA) 1,2; 3,4

### Library data of the parts
C130-C132 = CC0603_10UF_10V_10%_X5R: Non-polarised capacitor; Part Description: SMD Multilayer Chip Ceramic Capacitor; Manufacturer: GENERIC; Manufacturer1 Part Number: GRM188R61A106KE69D; Voltage: 10V; TC: X5R; Tolerance: ±10%; Part Number: CC0603_10UF_10V_10%_X5R; Component Kind: Standard; Component Type: Standard; Pin Count: 2; Value: 10uF; Status: None; Manufacturer Part Number: CC0603_10UF_10V_10%_X5R; Case: 0603; Mounted: Yes; Socket: No; SMD: Yes; Sense: No; Manufacturer1 Example: MURATA; Manufacturer1 ComponentHeight: 0.8mm; HelpURL: \\cern.ch\dfs\Applications\Altium\Datasheets\CC0603_MURATA_GRM188R61A106KE69D.pdf; Author: CERN DEM JLC; CreateDate: 31/01/2017; LatestRevisionDate: 31/01/2017
JB2 = 25286: Samtec Razor Beam REF-189017-02, LF-04.0, 60 Pins, für alle 4x5 SoMs; Mixed: SMT; Trenz-Stock: Yes; Trenz-Article-Number: 23838; AN: 25286; Part Number: LSHM-150-04.0-L-DV-A-S-K-TR
PB1 = PB_TYCO_FSM6JSMA: Push-Button Switch SPDT; Part Description: 12VDC 50mA SPST Tactile  Push-Button Switch; Manufacturer: TYCO ELECTRONICS; Manufacturer Part Number: FSM6JSMA or  4-1437565-9; PressFit: No; Part Number: PB_TYCO_FSM6JSMA; Component Kind: Standard; Component Type: Standard; Pin Count: 4; PackageDescription: Body 6mm x 6mm, Surface Mount Tactile Switches, TYCO ALCOSWITCH FSMJSMA Series; Family: Push Button; Mounted: Yes; Socket: No; SMD: Yes; Sense: No; Status: None; ComponentHeight: 7.11mm; HelpURL: \\cern.ch\dfs\Applications\Altium\Datasheets\PB_TYCO_FSM6JSMA.pdf; Author: CERN DEM JLC; CreateDate: 21-Jun-12; LatestRevisionDate: 21-Jun-12
R209 = R0603_NO-VALUE: Resistor; Part Description: Reserved Footprint For a 0603 (1608) Chip Resistor; PressFit: No; Mounted: No; Part Number: R0603_NO-VALUE; Component Kind: Standard; Component Type: Standard; Pin Count: 2; Value: Undefined; Status: None; Manufacturer: Undefined; Manufacturer Part Number: R0603_NO-VALUE; Case: 0603; Sense: No; Socket: No; SMD: Yes; Manufacturer1 Example: Undefined; Manufacturer1 Part Number: Undefined; Manufacturer1 ComponentHeight: Undefined; HelpURL: Undefined; Author: CERN DEM JLC; CreateDate: 03.12.2007; LatestRevisionDate: 13.03.2008
R210 = R0402_0R_JUMPER: as R116 on sheet TOP; Part Number: R0402_0R_JUMPER; Component Kind: Standard; Component Type: Standard; Pin Count: 2; Value: 0; Status: Not Recommended; Manufacturer Part Number: R0402_0R_JUMPER; Case: 0402; Mounted: Yes; Sense: No; Socket: No; SMD: Yes; Manufacturer1 Example: YAGEO PHYCOMP; Manufacturer1 ComponentHeight: 0.4mm; HelpURL: \\cern.ch\dfs\Applications\Altium\Datasheets\R0402_Phycomp_RC0402.pdf; Author: CERN DEM JLC; CreateDate: 03.12.2007; LatestRevisionDate: 17.10.2012

## Sheet SOM_JB1.SchDoc: SoM TE0720 JB1
size 420 x 297 mm; Author: P. Zdunek; DrawnBy: P. Zdunek; Organization: Altium Limited; Address1: L3, 12a Rodborough Rd; Address2: Frenchs Forest; Address3: NSW; Address4: Australia 2086; DocumentNumber: 3; SheetNumber: 3; SheetTotal: 37; ModifiedBy: -; CheckedDate: -; Title2: Fast Stabilizer; DivGrp: WUT ISE; Designer: G.Kasprowicz
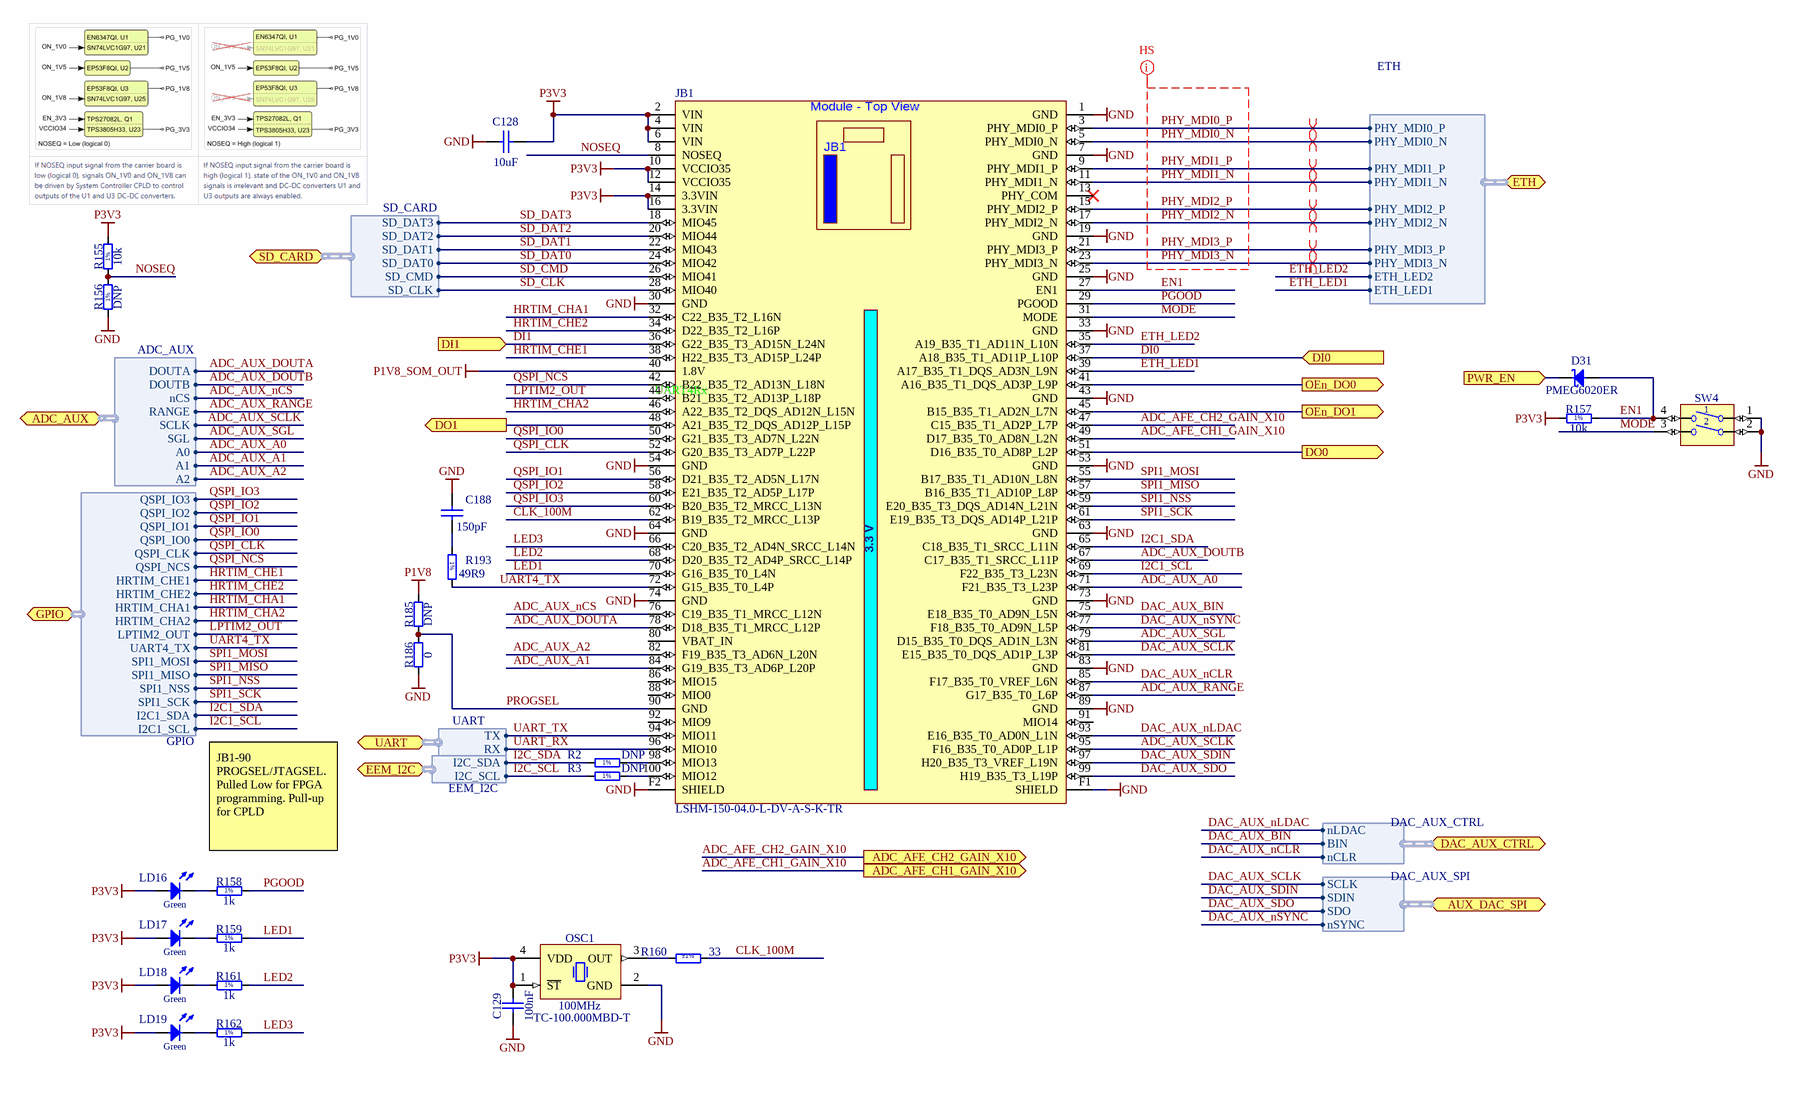
[diagram p3: SOM_JB1.SchDoc]

### Parts
C128  10uF  [CAPC1608X80N]
C129  100nF  [CAPC1005X55N]
C188  150pF  [CAPC1005X55N]
D31  PMEG6020ER  [SODFL3517X110N]
JB1  LSHM-150-04.0-L-DV-A-S-K-TR  [LSHM-150-XXX-X-DV-A-X]
LD16  Green  [LED_KINGBRIGHT_KPH-1608CGCK]
LD17  Green  [LED_KINGBRIGHT_KPH-1608CGCK]
LD18  Green  [LED_KINGBRIGHT_KPH-1608CGCK]
LD19  Green  [LED_KINGBRIGHT_KPH-1608CGCK]
OSC1  100MHz  Manufacturer Part Number: TC-100.000MBD-T  [OSC_CDFN3225-4LD-PL-1]
R2  DNP  [RESC1005X40N]
R3  DNP  [RESC1005X40N]
R155  10k  [RESC1005X40N]
R156  DNP  [RESC1005X40N]
R157  10k  [RESC1005X40N]
R158  1k  [RESC1005X40N]
R159  1k  [RESC1005X40N]
R160  33  Tolerance: ±1%  [RESC1005X40N]
R161  1k  [RESC1005X40N]
R162  1k  [RESC1005X40N]
R185  DNP  [RESC1005X40N]
R186  0  [RESC1005X40N]
R193  49R9  [RESC1005X40N]
SW4  Switch  [SW_OMRON_A6SN-2101]  (value not drawn)

### Ports
ADC_AFE_CH1_GAIN_X10 (out), ADC_AFE_CH2_GAIN_X10 (out), ADC_AUX (bidir, harness ADC_AUX), AUX_DAC_SPI (bidir, harness DAC_AUX_SPI), DAC_AUX_CTRL (bidir, harness DAC_AUX_CTRL), DI0 (in), DI1 (in), DO0 (out), DO1 (out), EEM_I2C (bidir, harness EEM_I2C), ETH (bidir, harness ETH), GPIO (bidir, harness GPIO), OEn_DO0 (out), OEn_DO1 (out), PWR_EN (in), SD_CARD (bidir, harness SD_CARD), UART (bidir, harness UART)

### Harnesses
ETH: PHY_MDI0_P, PHY_MDI0_N, PHY_MDI1_P, PHY_MDI1_N, PHY_MDI2_P, PHY_MDI2_N, PHY_MDI3_P, PHY_MDI3_N, ETH_LED2, ETH_LED1
SD_CARD: SD_DAT3, SD_DAT2, SD_DAT1, SD_DAT0, SD_CMD, SD_CLK
EEM_I2C: I2C_SDA, I2C_SCL
UART: TX, RX
ADC_AUX: SCLK, SGL, DOUTA, DOUTB, nCS, RANGE, A0, A1, A2
GPIO: QSPI_IO3, QSPI_IO2, QSPI_IO1, QSPI_IO0, QSPI_CLK, QSPI_NCS, HRTIM_CHE1, HRTIM_CHE2, HRTIM_CHA1, HRTIM_CHA2, LPTIM2_OUT, UART4_TX, SPI1_MOSI, SPI1_MISO, SPI1_NSS, SPI1_SCK, I2C1_SDA, I2C1_SCL
DAC_AUX_SPI: SCLK, SDIN, SDO, nSYNC
DAC_AUX_CTRL: nCLR, BIN, nLDAC

### Nets
GND: C128.2 C129.1 C188.2 JB1.1(GND) JB1.7(GND) JB1.19(GND) JB1.25(GND) JB1.30(GND) JB1.33(GND) JB1.43(GND) JB1.53(GND) JB1.54(GND) JB1.63(GND) JB1.64(GND) JB1.73(GND) JB1.74(GND) JB1.83(GND) JB1.89(GND) JB1.F1(SHIELD) JB1.F2(SHIELD) OSC1.2(GND) R156.1 R186.1 SW4.1 SW4.2
P1V8: R185.2
P1V8_SOM_OUT: JB1.40(1.8V)
P3V3: C128.1 C129.2 JB1.2(VIN) JB1.4(VIN) JB1.6(VIN) JB1.10(VCCIO35) JB1.12(VCCIO35) JB1.14(3.3VIN) JB1.16(3.3VIN) LD16.2(A) LD17.2(A) LD18.2(A) LD19.2(A) OSC1.1(~{ST}) OSC1.4(VDD) R155.2 R157.2
ADC_AFE_CH1_GAIN_X10: JB1.49(D17_B35_T0_AD8N_L2N) ; port ADC_AFE_CH1_GAIN_X10  [project net AFE_GAIN_X10]
ADC_AFE_CH2_GAIN_X10: JB1.47(C15_B35_T1_AD2P_L7P) ; port ADC_AFE_CH2_GAIN_X10  [project net AFE_GAIN_X10]
ADC_AUX_A0: JB1.71(F21_B35_T3_L23P) ; port ADC_AUX.A0
ADC_AUX_A1: JB1.84(G19_B35_T3_AD6P_L20P) ; port ADC_AUX.A1
ADC_AUX_A2: JB1.82(F19_B35_T3_AD6N_L20N) ; port ADC_AUX.A2
ADC_AUX_DOUTA: JB1.78(D18_B35_T1_MRCC_L12P) ; port ADC_AUX.DOUTA
ADC_AUX_DOUTB: JB1.67(C17_B35_T1_SRCC_L11P) ; port ADC_AUX.DOUTB
ADC_AUX_nCS: JB1.76(C19_B35_T1_MRCC_L12N) ; port ADC_AUX.nCS
ADC_AUX_RANGE: JB1.87(G17_B35_T0_L6P) ; port ADC_AUX.RANGE
ADC_AUX_SCLK: JB1.95(F16_B35_T0_AD0P_L1P) ; port ADC_AUX.SCLK
ADC_AUX_SGL: JB1.79(D15_B35_T0_DQS_AD1N_L3N) ; port ADC_AUX.SGL
CLK_100M: JB1.62(B19_B35_T2_MRCC_L13P) R160.2
DAC_AUX_BIN: JB1.75(E18_B35_T0_AD9N_L5N) ; port DAC_AUX_CTRL.BIN
DAC_AUX_nCLR: JB1.85(F17_B35_T0_VREF_L6N) ; port DAC_AUX_CTRL.nCLR
DAC_AUX_nLDAC: JB1.93(E16_B35_T0_AD0N_L1N) ; port DAC_AUX_CTRL.nLDAC
DAC_AUX_nSYNC: JB1.77(F18_B35_T0_AD9N_L5P) ; port AUX_DAC_SPI.nSYNC
DAC_AUX_SCLK: JB1.81(E15_B35_T0_DQS_AD1P_L3P) ; port AUX_DAC_SPI.SCLK
DAC_AUX_SDIN: JB1.97(H20_B35_T3_VREF_L19N) ; port AUX_DAC_SPI.SDIN
DAC_AUX_SDO: JB1.99(H19_B35_T3_L19P) ; port AUX_DAC_SPI.SDO
DI0: JB1.37(A18_B35_T1_AD11P_L10P) ; port DI0
DI1: JB1.36(G22_B35_T3_AD15N_L24N) ; port DI1
DO0: JB1.51(D16_B35_T0_AD8P_L2P) ; port DO0
DO1: JB1.48(A21_B35_T2_DQS_AD12P_L15P) ; port DO1
EN1: D31.2(A) JB1.27(EN1) R157.1 SW4.4
ETH_LED1: JB1.39(A17_B35_T1_DQS_AD3N_L9N) ; port ETH.ETH_LED1
ETH_LED2: JB1.35(A19_B35_T1_AD11N_L10N) ; port ETH.ETH_LED2
HRTIM_CHA1: JB1.32(C22_B35_T2_L16N) ; port GPIO.HRTIM_CHA1
HRTIM_CHA2: JB1.46(A22_B35_T2_DQS_AD12N_L15N) ; port GPIO.HRTIM_CHA2
HRTIM_CHE1: JB1.38(H22_B35_T3_AD15P_L24P) ; port GPIO.HRTIM_CHE1
HRTIM_CHE2: JB1.34(D22_B35_T2_L16P) ; port GPIO.HRTIM_CHE2
I2C1_SCL: JB1.69(F22_B35_T3_L23N) ; port GPIO.I2C1_SCL
I2C1_SDA: JB1.65(C18_B35_T1_SRCC_L11N) ; port GPIO.I2C1_SDA
I2C_SCL: R3.1 ; port EEM_I2C.I2C_SCL  [project net SoC_I2C_SCL]
I2C_SDA: R2.1 ; port EEM_I2C.I2C_SDA  [project net SoC_I2C_SDA]
LED1: JB1.70(G16_B35_T0_L4N) R159.2
LED2: JB1.68(D20_B35_T2_AD4P_SRCC_L14P) R161.2
LED3: JB1.66(C20_B35_T2_AD4N_SRCC_L14N) R162.2
LPTIM2_OUT: JB1.44(B21_B35_T2_AD13P_L18P) ; port GPIO.LPTIM2_OUT
MODE: JB1.31(MODE) SW4.3
NOSEQ: JB1.8(NOSEQ) R155.1 R156.2
OEn_DO0: JB1.41(A16_B35_T1_DQS_AD3P_L9P) ; port OEn_DO0
OEn_DO1: JB1.45(B15_B35_T1_AD2N_L7N) ; port OEn_DO1
PGOOD: JB1.29(PGOOD) R158.2
PHY_MDI0_N: JB1.5(PHY_MDI0_N) ; port ETH.PHY_MDI0_N
PHY_MDI0_P: JB1.3(PHY_MDI0_P) ; port ETH.PHY_MDI0_P
PHY_MDI1_N: JB1.11(PHY_MDI1_N) ; port ETH.PHY_MDI1_N
PHY_MDI1_P: JB1.9(PHY_MDI1_P) ; port ETH.PHY_MDI1_P
PHY_MDI2_N: JB1.17(PHY_MDI2_N) ; port ETH.PHY_MDI2_N
PHY_MDI2_P: JB1.15(PHY_MDI2_P) ; port ETH.PHY_MDI2_P
PHY_MDI3_N: JB1.23(PHY_MDI3_N) ; port ETH.PHY_MDI3_N
PHY_MDI3_P: JB1.21(PHY_MDI3_P) ; port ETH.PHY_MDI3_P
PROGSEL: JB1.90(GND) R185.1 R186.2
PWR_EN: D31.1(C) ; port PWR_EN
QSPI_CLK: JB1.52(G20_B35_T3_AD7P_L22P) ; port GPIO.QSPI_CLK
QSPI_IO0: JB1.50(G21_B35_T3_AD7N_L22N) ; port GPIO.QSPI_IO0
QSPI_IO1: JB1.56(D21_B35_T2_AD5N_L17N) ; port GPIO.QSPI_IO1
QSPI_IO2: JB1.58(E21_B35_T2_AD5P_L17P) ; port GPIO.QSPI_IO2
QSPI_IO3: JB1.60(B20_B35_T2_MRCC_L13N) ; port GPIO.QSPI_IO3
QSPI_NCS: JB1.42(B22_B35_T2_AD13N_L18N) ; port GPIO.QSPI_NCS
SD_CLK: JB1.28(MIO40) ; port SD_CARD.SD_CLK
SD_CMD: JB1.26(MIO41) ; port SD_CARD.SD_CMD
SD_DAT0: JB1.24(MIO42) ; port SD_CARD.SD_DAT0
SD_DAT1: JB1.22(MIO43) ; port SD_CARD.SD_DAT1
SD_DAT2: JB1.20(MIO44) ; port SD_CARD.SD_DAT2
SD_DAT3: JB1.18(MIO45) ; port SD_CARD.SD_DAT3
SPI1_MISO: JB1.57(B16_B35_T1_AD10P_L8P) ; port GPIO.SPI1_MISO
SPI1_MOSI: JB1.55(B17_B35_T1_AD10N_L8N) ; port GPIO.SPI1_MOSI
SPI1_NSS: JB1.59(E20_B35_T3_DQS_AD14N_L21N) ; port GPIO.SPI1_NSS
SPI1_SCK: JB1.61(E19_B35_T3_DQS_AD14P_L21P) ; port GPIO.SPI1_SCK
UART4_TX: JB1.72(G15_B35_T0_L4P) R193.2 ; port GPIO.UART4_TX
UART_RX: JB1.96(MIO10) ; port UART.RX
UART_TX: JB1.94(MIO11) ; port UART.TX
NetC188_1: C188.1 R193.1
NetJB1_98: JB1.98(MIO13) R2.2
NetJB1_100: JB1.100(MIO12) R3.2
NetLD16_1: LD16.1(C) R158.1
NetLD17_1: LD17.1(C) R159.1
NetLD18_1: LD18.1(C) R161.1
NetLD19_1: LD19.1(C) R162.1
NetOSC1_3: OSC1.3(OUT) R160.1

Not connected (* = marked no-connect by the designer): JB1 13(PHY_COM)* 80(VBAT_IN) 86(MIO15) 88(MIO0) 91(MIO14) 92(MIO9)

### Layout directives
differential pair: PHY_MDI0_N, PHY_MDI0_P, PHY_MDI1_N, PHY_MDI1_P, PHY_MDI2_N, PHY_MDI2_P, PHY_MDI3_N, PHY_MDI3_P
net class HIGH_SPEED: PHY_MDI0_N, PHY_MDI0_P, PHY_MDI1_N, PHY_MDI1_P, PHY_MDI2_N, PHY_MDI2_P, PHY_MDI3_N, PHY_MDI3_P

### Notes on the sheet
- (near JB1) UART4Rx
- (near JB1) 3.3 V
- JB1-90 PROGSEL/JTAGSEL. Pulled Low for FPGA programming. Pull-up for CPLD
- Project/Equipment
- Document
- Designer
- Drawn by
- Check.by
- Copyright WUT ISE 2020.
  This documentation describes Open Hardware and is licensed under the CERN OHL v.1.2. You may redistribute and modify this documentation under the terms of the CERN OHL v.1.2. (http://ohwr.org/CERNOHL). This documentation is distributed WITHOUT ANY EXPRESS OR IMPLIED WARRANTY, INCLUDING OF MERCHANTABILITY, SATISFACTORY QUALITY AND FITNESS FOR A PARTICULAR PURPOSE. Please see the CERN OHL v.1.2 for applicable conditions.
- Contact
- File
- Last Mod.
- Print Date
- Sheet
- Size
- A3
- of
- Rev
- (in symbol 25285) Module - Top View
- (in symbol R0402_1K_1%_0.0625W_100PPM) 1%
- (in symbol R0402_2K4_1%_0.0625W_100PPM) 1%
- (in symbol R0402_10K_1%_0.0625W_100PPM) 1%
- (in symbol R0402_49R9_1%_0.0625W_100PPM) 1%

### Library data of the parts
C128 = CC0603_10UF_10V_10%_X5R: as C130 on sheet SOM_JB2; Part Number: CC0603_10UF_10V_10%_X5R; Component Kind: Standard; Component Type: Standard; Pin Count: 2; Value: 10uF; Status: None; Manufacturer Part Number: CC0603_10UF_10V_10%_X5R; Case: 0603; Mounted: Yes; Socket: No; SMD: Yes; Sense: No; Manufacturer1 Example: MURATA; Manufacturer1 ComponentHeight: 0.8mm; HelpURL: \\cern.ch\dfs\Applications\Altium\Datasheets\CC0603_MURATA_GRM188R61A106KE69D.pdf; Author: CERN DEM JLC; CreateDate: 31/01/2017; LatestRevisionDate: 31/01/2017
C129 = CC0402_100NF_16V_10%_X5R: Non-polarised capacitor; Manufacturer: GENERIC; Part Description: SMD Multilayer Chip Ceramic Capacitor; Manufacturer1 Part Number: GRM155R61C104KA88D; Voltage: 16V; TC: X5R; Tolerance: ±10%; Part Number: CC0402_100NF_16V_10%_X5R; Component Kind: Standard; Component Type: Standard; Pin Count: 2; Value: 100nF; Status: None; Manufacturer Part Number: CC0402_100NF_16V_10%_X5R; Case: 0402; Mounted: Yes; Socket: No; SMD: Yes; Sense: No; Manufacturer1 Example: MURATA; Manufacturer1 ComponentHeight: 0.55mm; HelpURL: \\cern.ch\dfs\Applications\Altium\Datasheets\CC0402_X5R_MURATA_GRM.pdf; Author: CERN DEM JLC; CreateDate: 10/12/2013; LatestRevisionDate: 10/12/2013
C188 = CC0402_150PF_50V_5%_C0G: Non-polarised capacitor; Part Description: SMD Multilayer Chip Ceramic Capacitor; Manufacturer: GENERIC; Manufacturer1 Part Number: C0402C151J5GACTU; Voltage: 50V; TC: C0G/NP0; Tolerance: ±5%; Part Number: CC0402_150PF_50V_5%_C0G; Component Kind: Standard; Component Type: Standard; Pin Count: 2; Value: 150pF; Status: Preferred; Manufacturer Part Number: CC0402_150PF_50V_5%_C0G; Case: 0402; Mounted: Yes; Socket: No; SMD: Yes; Sense: No; Manufacturer1 Example: KEMET; Manufacturer1 ComponentHeight: 0.55mm; HelpURL: \\cern.ch\dfs\Applications\Altium\Datasheets\CC0402_C0G_KEMET_(Commercial Grade).pdf; Author: CERN DEM JLC; CreateDate: 03.12.2007; LatestRevisionDate: 22.04.2015
D31 = PMEG6020ER: Schottky Diode; Part Description: MEGA Schottky Barrier Rectifier; Manufacturer: NXP SEMICONDUCTORS; Voltage: 60V; Power: 2A; PressFit: No; Bonding: No; Part Number: PMEG6020ER; Component Kind: Standard; Component Type: Standard; Device: PMEG6020ER; PackageDescription: SODFL Diode (SOD123W); 2.60mm W X 1.70mm L X 1.10mm H body, IPC Medium Density; Manufacturer Part Number: PMEG6020ER; Pin Count: 2; Case: SOD-123FL; Mounted: Yes; Socket: No; SMD: Yes; Sense: No; ComponentHeight: 1.1mm; HelpURL: \\cern.ch\dfs\Applications\Altium\Datasheets\PMEG6020ER.pdf; Author: CERN DEM JMW; CreateDate: 19.06.2014; LatestRevisionDate: 19.06.2014
JB1 = 25285: Samtec Razor Beam REF-189016-02, LF-04.0, 100 Pins, für alle 4x5 SoMs; Mixed: SMT; Trenz-Stock: Yes; Trenz-Article-Number: 23838; AN: 25285; Part Number: LSHM-150-04.0-L-DV-A-S-K-TR
LD16-LD19 = LED_KINGBRIGHT_KPH-1608CGCK: LED Green 1C 2A; Part Description: SMD Green LED, Case 1.6mmX0.8mm(0603), 0.65mm Thickness; PressFit: No; Bonding: No; Part Number: LED_KINGBRIGHT_KPH-1608CGCK; Component Kind: Standard; Component Type: Standard; Color: Green; PackageDescription: SMT Green LED, Case 0603, Body L 1.6 x W 0.8mm H 0.65mm; Manufacturer: KINGBRIGHT; Manufacturer Part Number: KPH-1608CGCK; Pin Count: 2; Mounted: Yes; Socket: No; SMD: Yes; Sense: No; ComponentHeight: 0.65mm; HelpURL: \\cern.ch\dfs\Applications\Altium\Datasheets\LED_KINGBRIGHT_KPH-1608CGCK.pdf; Author: CERN DEM JLC; CreateDate: 03/07/2017; LatestRevisionDate: 03/07/2017
OSC1 = OSC_TC-100.000MBD-T: Oscillator MEMS 100MHz ±25ppm; Part Description: 1.8V-3.3V, ±25ppm, 15pF, -40..105°C, Surface Mount Low-Power Precision MEMS Oscillator; Manufacturer: TXC; PressFit: No; Bonding: No; Part Number: TC-100.000MBD-T; Component Kind: Standard; Component Type: Standard; Footprint: CDFN3225-4LD-PL-1; PackageDescription: DFN, 4 pins, 3.2mm x 2.5mm; Value: 100MHz; Pin Count: 4; Mounted: Yes; Socket: No; SMD: Yes; Sense: No; ComponentHeight: 0.9mm; HelpURL: \\cern.ch\dfs\Applications\Altium\Datasheets\OSC_MICROCHIP_DSC1001.pdf; Author: GK; CreateDate: 24.02.2021; LatestRevisionDate: 24.02.2021
R2 R3 = R0402_2K4_1%_0.0625W_100PPM: Resistor - 1%; Part Description: General Purpose Thick Film Chip Resistor; Manufacturer: GENERIC; Manufacturer1 Part Number: 232270672402L; Value: 2k4; TC: ±100ppm/°C; PressFit: No; Part Number: R0402_2K4_1%_0.0625W_100PPM; Component Kind: Standard; Component Type: Standard; Pin Count: 2; Status: Not Recommended; Power: 0.0625W; Tolerance: ±1%; Manufacturer Part Number: R0402_2K4_1%_0.0625W_100PPM; Case: 0402; Mounted: Yes; Sense: No; Socket: No; SMD: Yes; Manufacturer1 Example: YAGEO PHYCOMP; Manufacturer1 ComponentHeight: 0.4mm; HelpURL: \\cern.ch\dfs\Applications\Altium\Datasheets\R0402_Phycomp_RC0402.pdf; Author: CERN DEM JLC; CreateDate: 03.12.2007; LatestRevisionDate: 17.10.2012
R155 R157 = R0402_10K_1%_0.0625W_100PPM: Resistor - 1%; Part Description: General Purpose Thick Film Chip Resistor; Manufacturer: GENERIC; Manufacturer1 Part Number: 232270671003L; PressFit: No; TC: ±100ppm/°C; Part Number: R0402_10K_1%_0.0625W_100PPM; Component Kind: Standard; Component Type: Standard; Pin Count: 2; Value: 10k; Status: Not Recommended; Manufacturer Part Number: R0402_10K_1%_0.0625W_100PPM; Case: 0402; Mounted: Yes; Sense: No; Socket: No; SMD: Yes; Manufacturer1 Example: YAGEO PHYCOMP; Manufacturer1 ComponentHeight: 0.4mm; HelpURL: \\cern.ch\dfs\Applications\Altium\Datasheets\R0402_Phycomp_RC0402.pdf; Author: CERN DEM JLC; CreateDate: 03-Dec-07; LatestRevisionDate: 17-Oct-12; Power: 0.0625W; Tolerance: ±1%
R156 = R0402_10K_1%_0.0625W_100PPM: Resistor - 1%; Part Description: General Purpose Thick Film Chip Resistor; Manufacturer: GENERIC; Manufacturer1 Part Number: 232270671003L; Value: 10k; PressFit: No; TC: ±100ppm/°C; Part Number: R0402_10K_1%_0.0625W_100PPM; Component Kind: Standard; Component Type: Standard; Pin Count: 2; Status: Not Recommended; Manufacturer Part Number: R0402_10K_1%_0.0625W_100PPM; Case: 0402; Mounted: Yes; Sense: No; Socket: No; SMD: Yes; Manufacturer1 Example: YAGEO PHYCOMP; Manufacturer1 ComponentHeight: 0.4mm; HelpURL: \\cern.ch\dfs\Applications\Altium\Datasheets\R0402_Phycomp_RC0402.pdf; Author: CERN DEM JLC; CreateDate: 03-Dec-07; LatestRevisionDate: 17-Oct-12; Power: 0.0625W; Tolerance: ±1%
R158 R159 R161 R162 = R0402_1K_1%_0.0625W_100PPM: Resistor - 1%; Part Description: General Purpose Thick Film Chip Resistor; Manufacturer: GENERIC; Manufacturer1 Part Number: 232270671002L; TC: ±100ppm/°C; PressFit: No; Part Number: R0402_1K_1%_0.0625W_100PPM; Component Kind: Standard; Component Type: Standard; Pin Count: 2; Value: 1k; Status: Not Recommended; Power: 0.0625W; Tolerance: ±1%; Manufacturer Part Number: R0402_1K_1%_0.0625W_100PPM; Case: 0402; Mounted: Yes; Sense: No; Socket: No; SMD: Yes; Manufacturer1 Example: YAGEO PHYCOMP; Manufacturer1 ComponentHeight: 0.4mm; HelpURL: \\cern.ch\dfs\Applications\Altium\Datasheets\R0402_Phycomp_RC0402.pdf; Author: CERN DEM JLC; CreateDate: 03.12.2007; LatestRevisionDate: 17.10.2012
R160 = R0402_33R_1%_0.0625W_100PPM: Resistor - 1%; Part Description: General Purpose Thick Film Chip Resistor; Manufacturer: GENERIC; Manufacturer1 Part Number: 232270673309L; TC: ±100ppm/°C; PressFit: No; Part Number: R0402_33R_1%_0.0625W_100PPM; Component Kind: Standard; Component Type: Standard; Pin Count: 2; Value: 33; Status: Not Recommended; Power: 0.0625W; Manufacturer Part Number: R0402_33R_1%_0.0625W_100PPM; Case: 0402; Mounted: Yes; Sense: No; Socket: No; SMD: Yes; Manufacturer1 Example: YAGEO PHYCOMP; Manufacturer1 ComponentHeight: 0.4mm; HelpURL: \\cern.ch\dfs\Applications\Altium\Datasheets\R0402_Phycomp_RC0402.pdf; Author: CERN DEM JLC; CreateDate: 03.12.2007; LatestRevisionDate: 17.10.2012
R185 = R0402_0R_JUMPER: Resistor; Part Description: 1A (0.05R Max DC Resistance) Zero Ohm Jumper; Manufacturer: GENERIC; Manufacturer1 Part Number: 232270591001L; Value: 0; PressFit: No; Part Number: R0402_0R_JUMPER; Component Kind: Standard; Component Type: Standard; Pin Count: 2; Status: Not Recommended; Manufacturer Part Number: R0402_0R_JUMPER; Case: 0402; Mounted: Yes; Sense: No; Socket: No; SMD: Yes; Manufacturer1 Example: YAGEO PHYCOMP; Manufacturer1 ComponentHeight: 0.4mm; HelpURL: \\cern.ch\dfs\Applications\Altium\Datasheets\R0402_Phycomp_RC0402.pdf; Author: CERN DEM JLC; CreateDate: 03/12/2007; LatestRevisionDate: 17/10/2012
R186 = R0402_0R_JUMPER: as R116 on sheet TOP; Part Number: R0402_0R_JUMPER; Component Kind: Standard; Component Type: Standard; Pin Count: 2; Value: 0; Status: Not Recommended; Manufacturer Part Number: R0402_0R_JUMPER; Case: 0402; Mounted: Yes; Sense: No; Socket: No; SMD: Yes; Manufacturer1 Example: YAGEO PHYCOMP; Manufacturer1 ComponentHeight: 0.4mm; HelpURL: \\cern.ch\dfs\Applications\Altium\Datasheets\R0402_Phycomp_RC0402.pdf; Author: CERN DEM JLC; CreateDate: 03/12/2007; LatestRevisionDate: 17/10/2012
R193 = R0402_49R9_1%_0.0625W_100PPM: Resistor - 1%; Part Description: General Purpose Thick Film Chip Resistor; Manufacturer: GENERIC; Manufacturer1 Part Number: 232270674999L or RC0402FR-0749R9L; TC: ±100ppm/°C; Table: Resistors SMD; Part Number: R0402_49R9_1%_0.0625W_100PPM; Component Kind: Standard; Component Type: Standard; Pin Count: 2; Value: 49R9; Status: Not recommended; Power: 0.0625W; Tolerance: ±1%; Manufacturer Part Number: R0402_49R9_1%_0.0625W_100PPM; Case: 0402; Mounted: Yes; Socket: No; SMD: Yes; Manufacturer1 Example: YAGEO PHYCOMP; Manufacturer1 ComponentHeight: 0.4mm; HelpURL: \\cern.ch\dfs\Applications\Altium\Datasheets\R0402_Phycomp_RC0402.pdf; Author: CERN DEM JLC; CreateDate: 2012-10-24; LatestRevisionDate: 2012-10-24
SW4 = SW_OMRON_A6SN-2101: 2 Ways SPST DIP Switch; Part Description: 2 Ways SPST Surface-Mounting Slide Switch With Flat Actuator, Contact Rating 25mA 24VDC; Manufacturer: OMRON; PressFit: No; Part Number: SW_OMRON_A6SN-2101; Component Kind: Standard; Component Type: Standard; Pin Count: 4; PackageDescription: Pitch 2.54mm, Body 7x7.5, 2 Ways SPST Surface-Mounting Slide Switch With Flat Actuator (A6SN Series); Family: Switch; Mounted: Yes; Socket: No; SMD: Yes; Sense: No; Status: None; Manufacturer Part Number: A6SN-2101; ComponentHeight: 4.6mm; HelpURL: \\cern.ch\dfs\Applications\Altium\Datasheets\SW_OMRON_A6SN-2101.pdf; Author: CERN DEM MR; CreateDate: 04-Nov-16; LatestRevisionDate: 04-Nov-16